# EasyEDA schematic Schematic_Ocean-240.2_v1.0.0.json

## Sheets
1 CPU: TITLE: "Океан 240.2" - CPU, ROM, Синхронизация; REV: 1.0.0; Date: 2025-08-15; Sheet: 1/7; Drawn By: Roman Boykov; Company: Romych's home
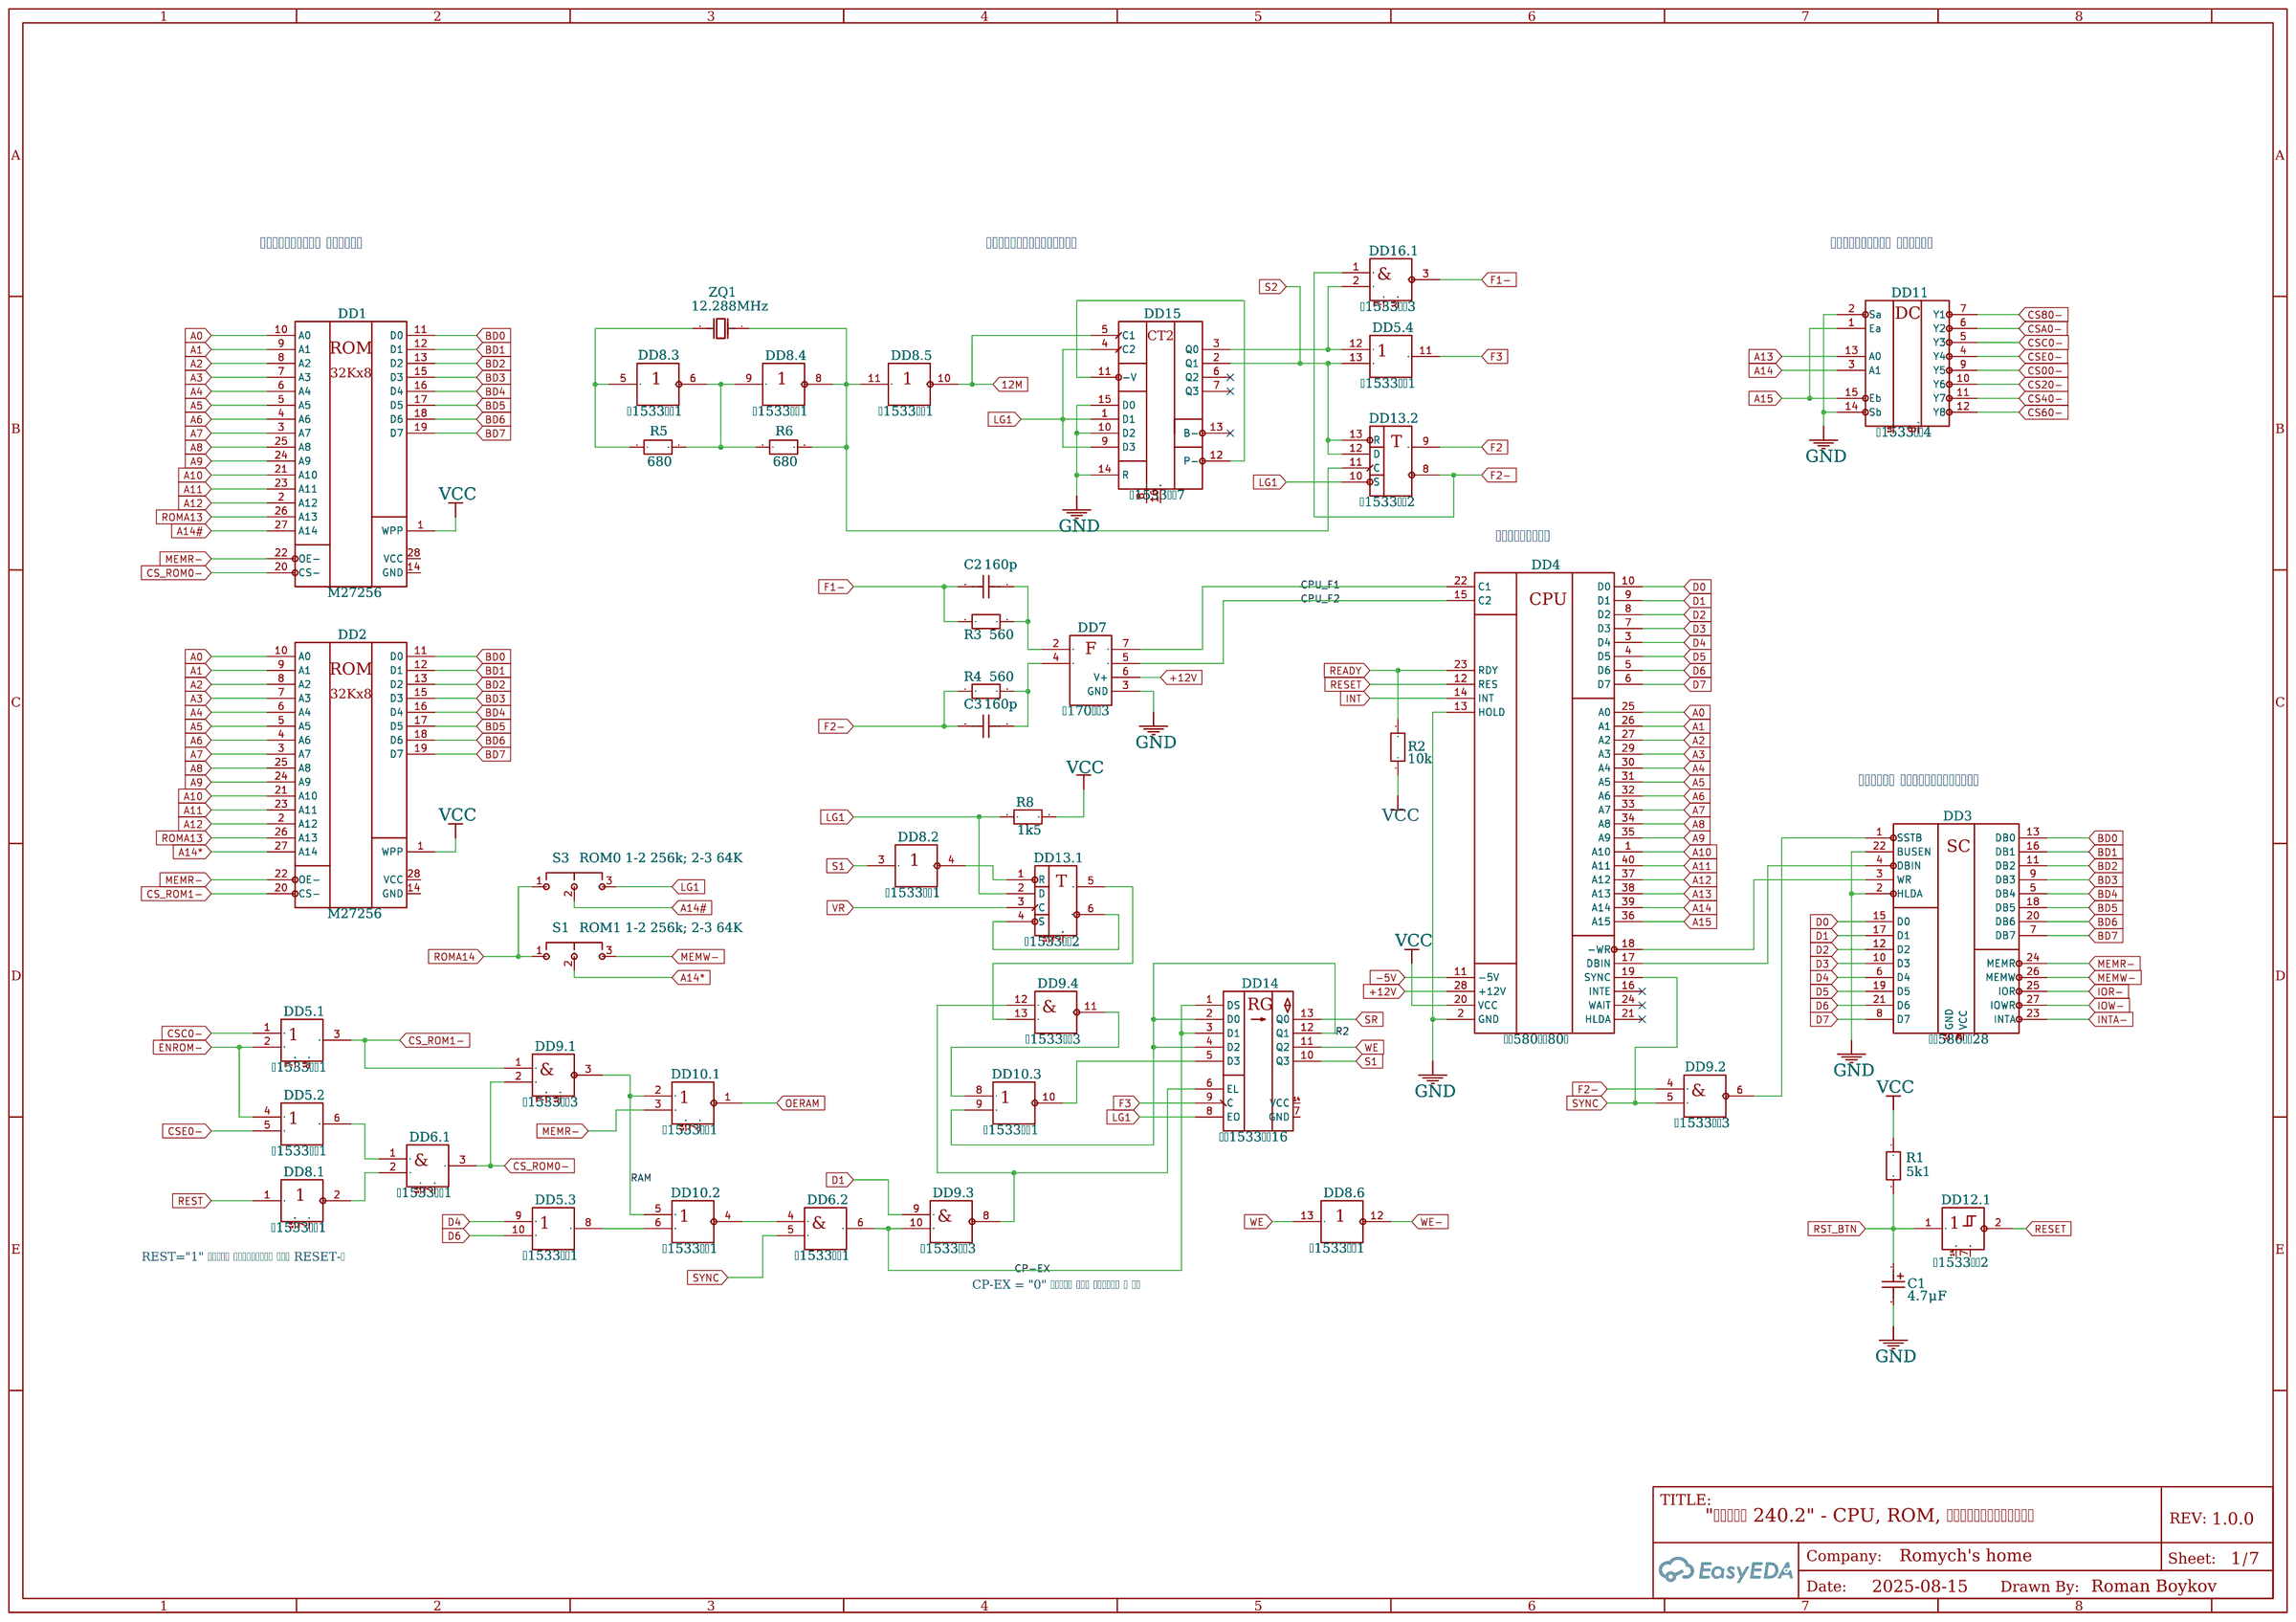
[diagram p0: CPU]
2 RAM_CTR: TITLE: "Океан 240.2" - Устройство управления ОЗУ; Sheet: 2/7
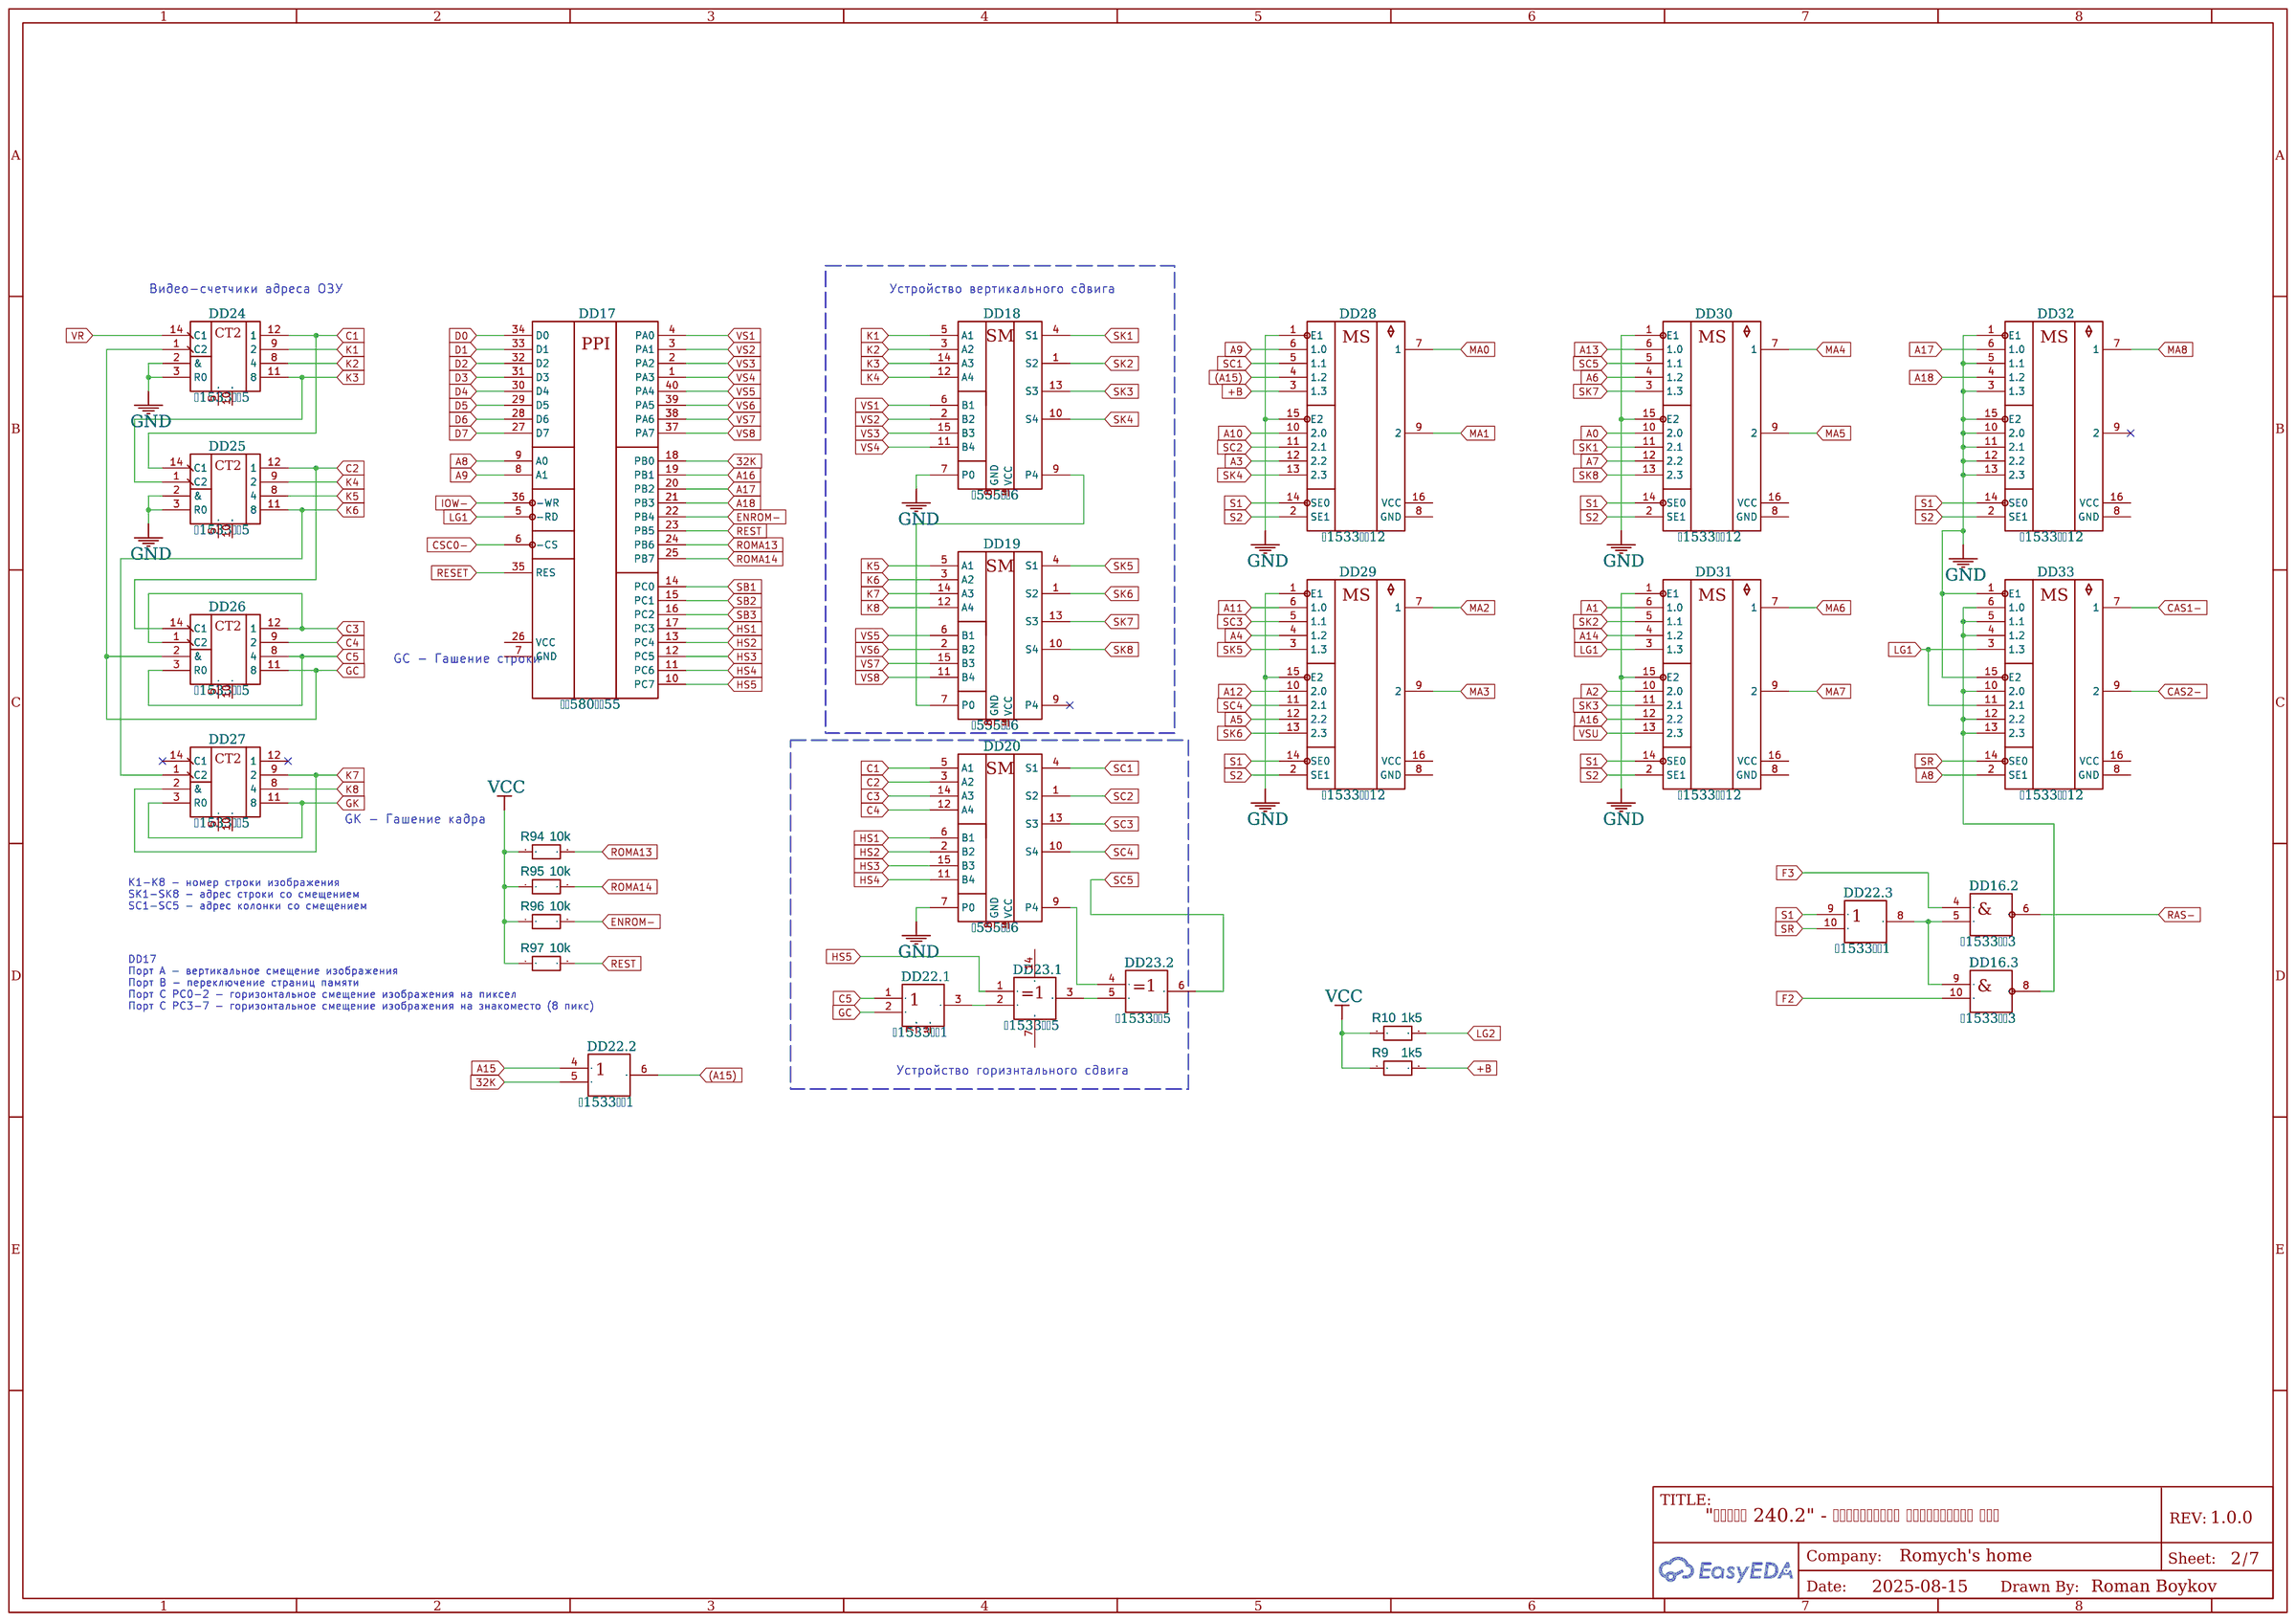
[diagram p1: RAM_CTR]
3 DRAM: TITLE: "Океан 240.2" - DRAM; Sheet: 3/7
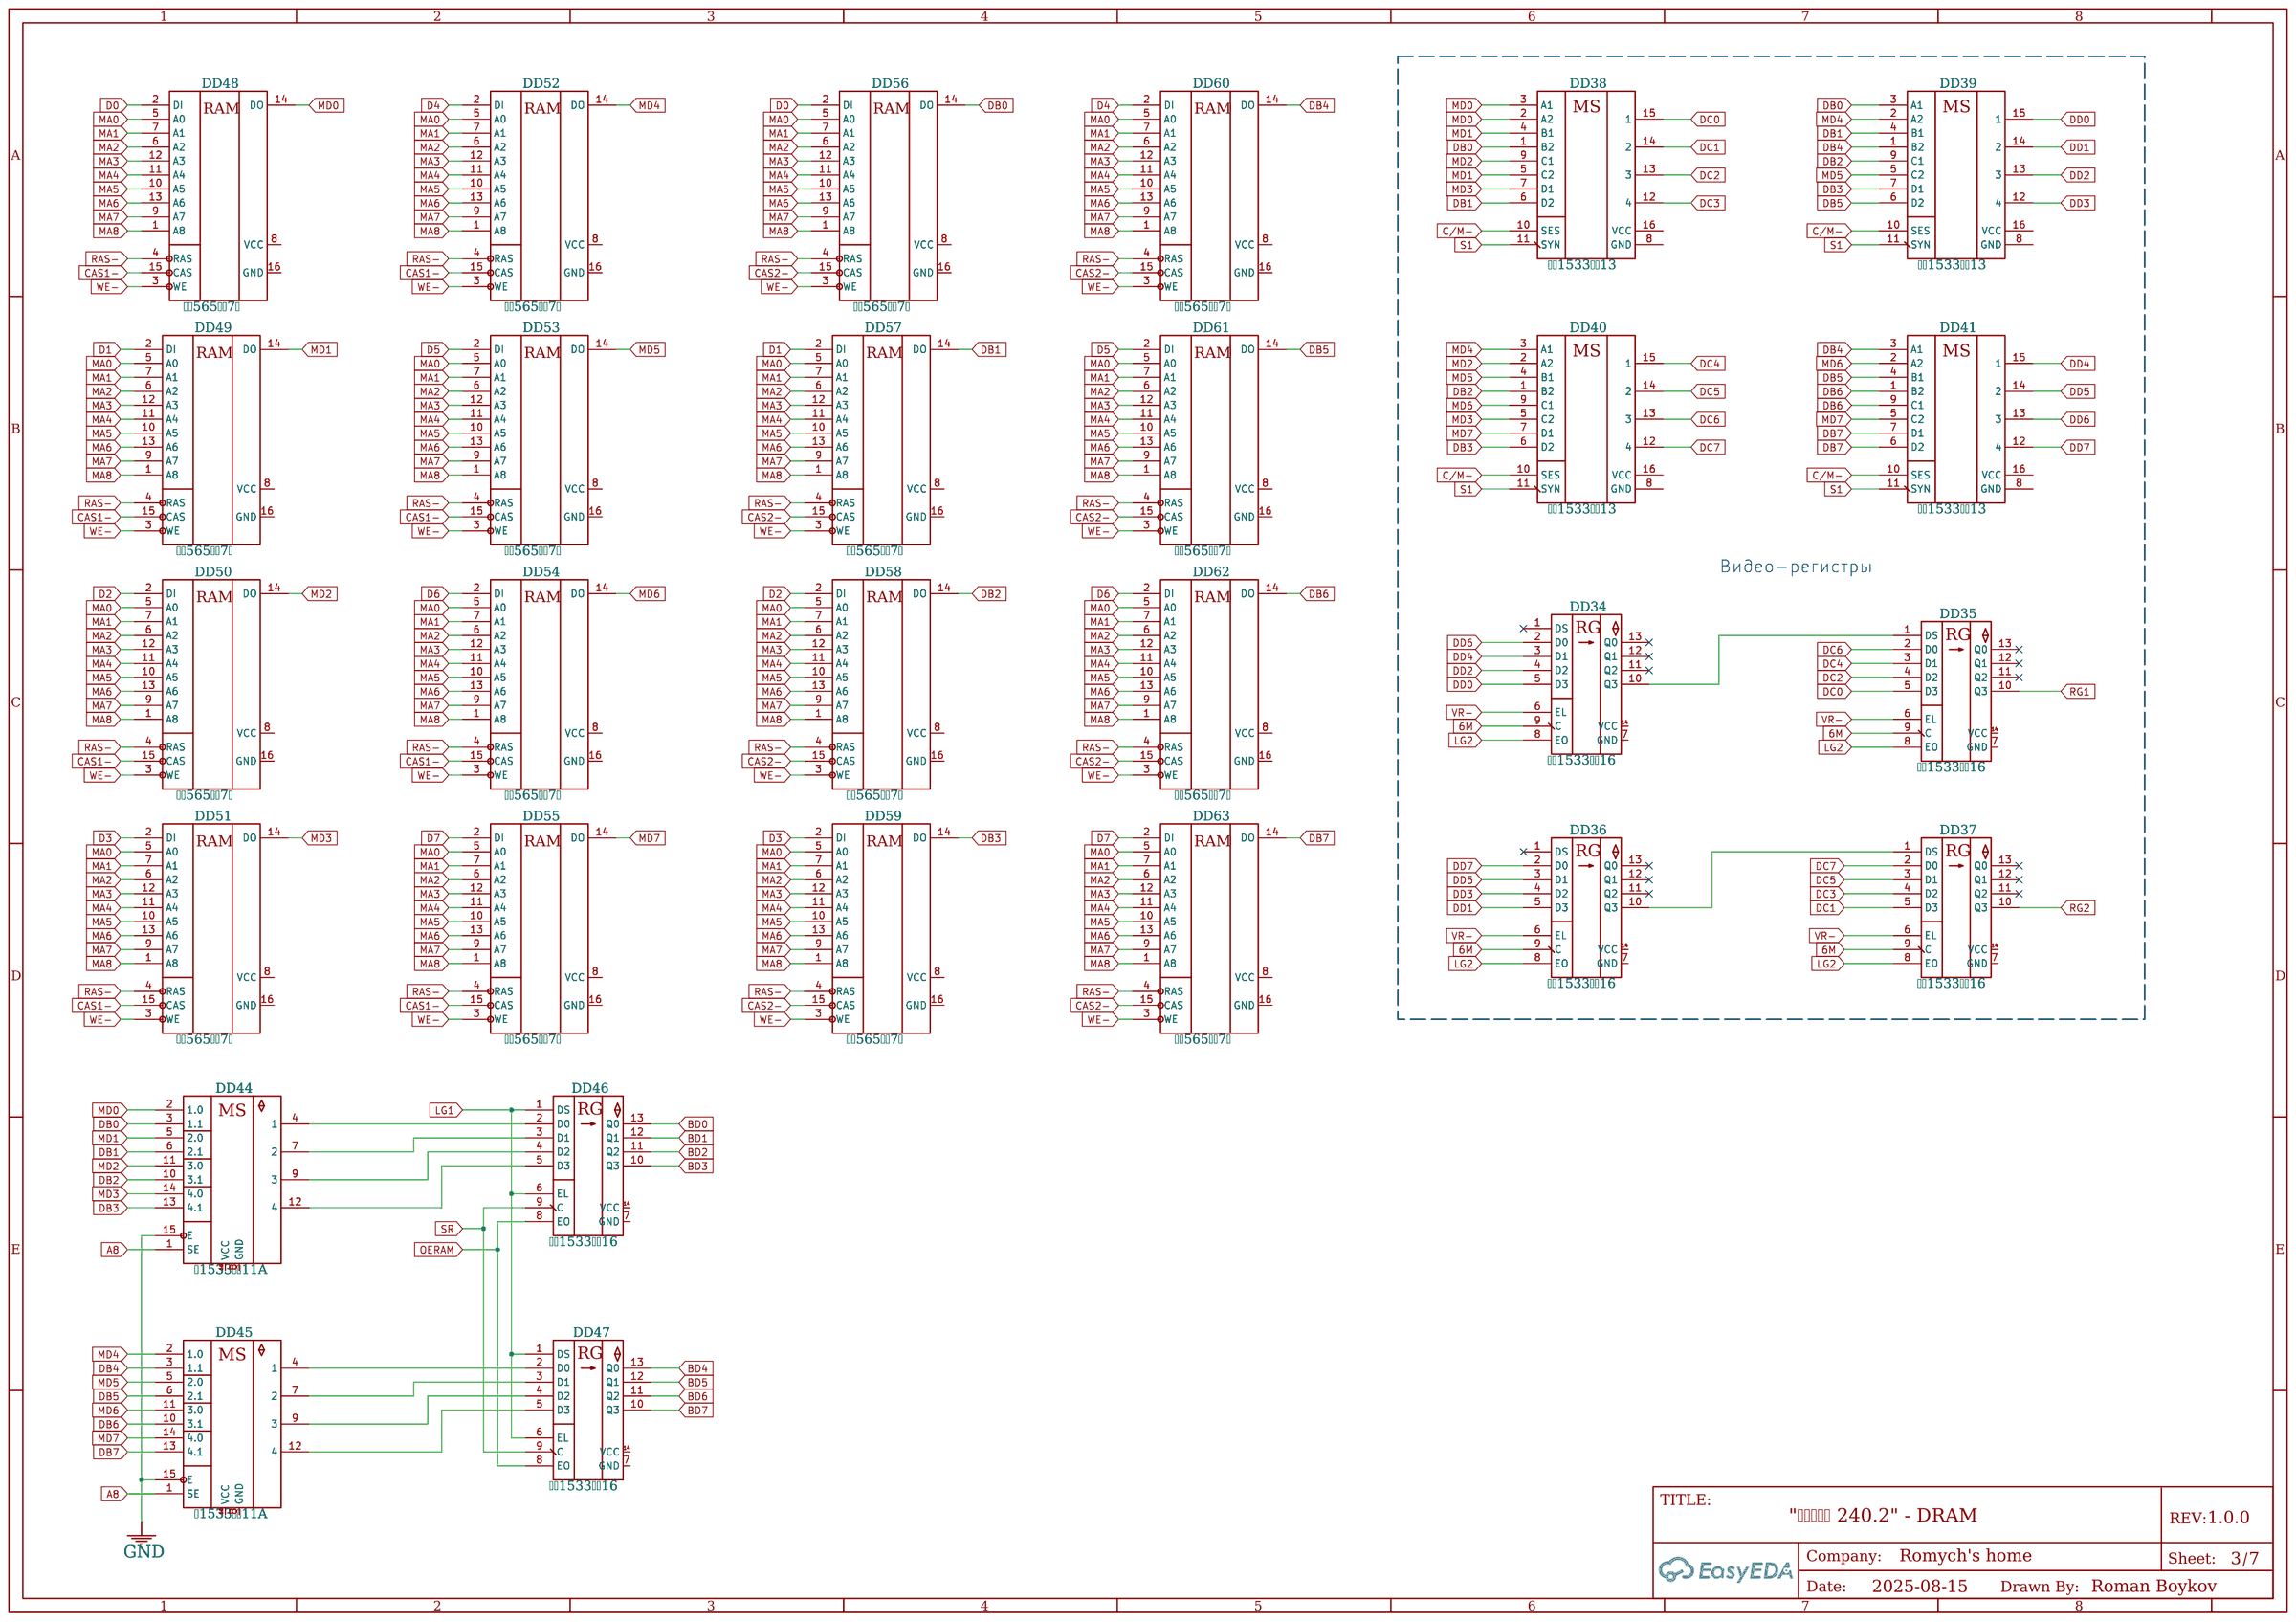
[diagram p2: DRAM]
4 Video: TITLE: "Океан 240.2" - Видео; Sheet: 4/7
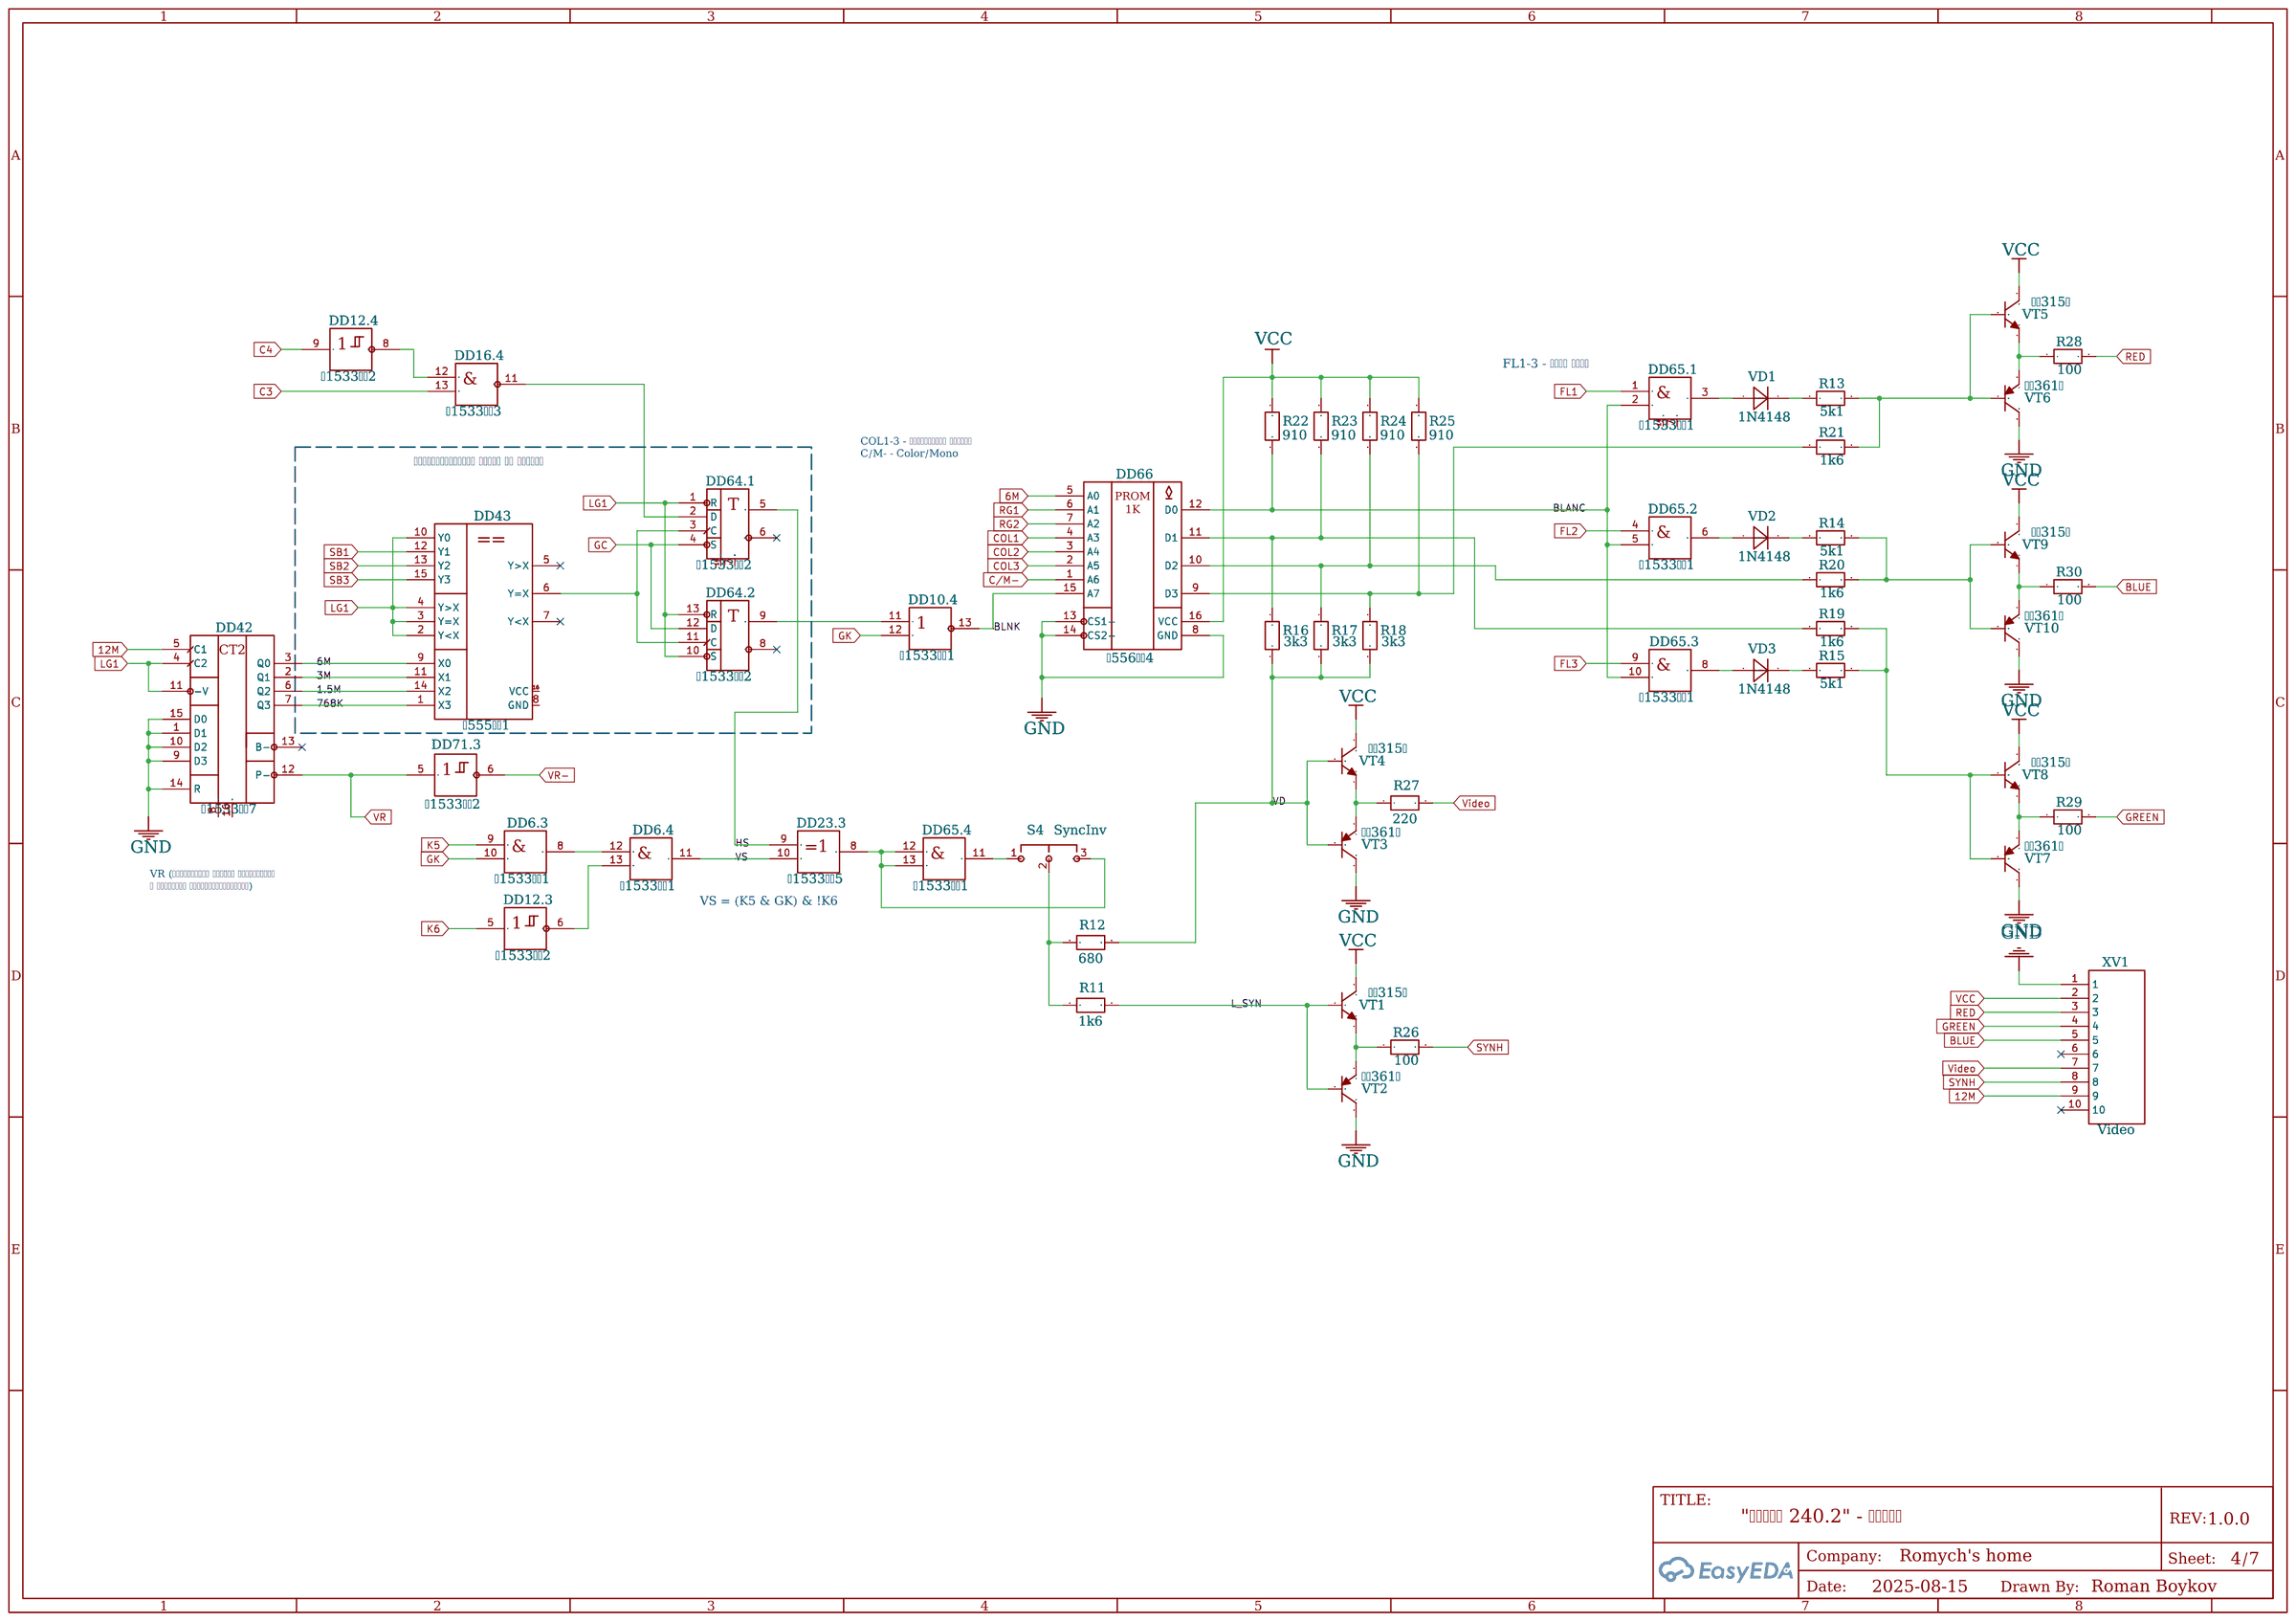
[diagram p3: Video]
5 Power: TITLE: "Океан 240.2" - Источник питания; Sheet: 5/7
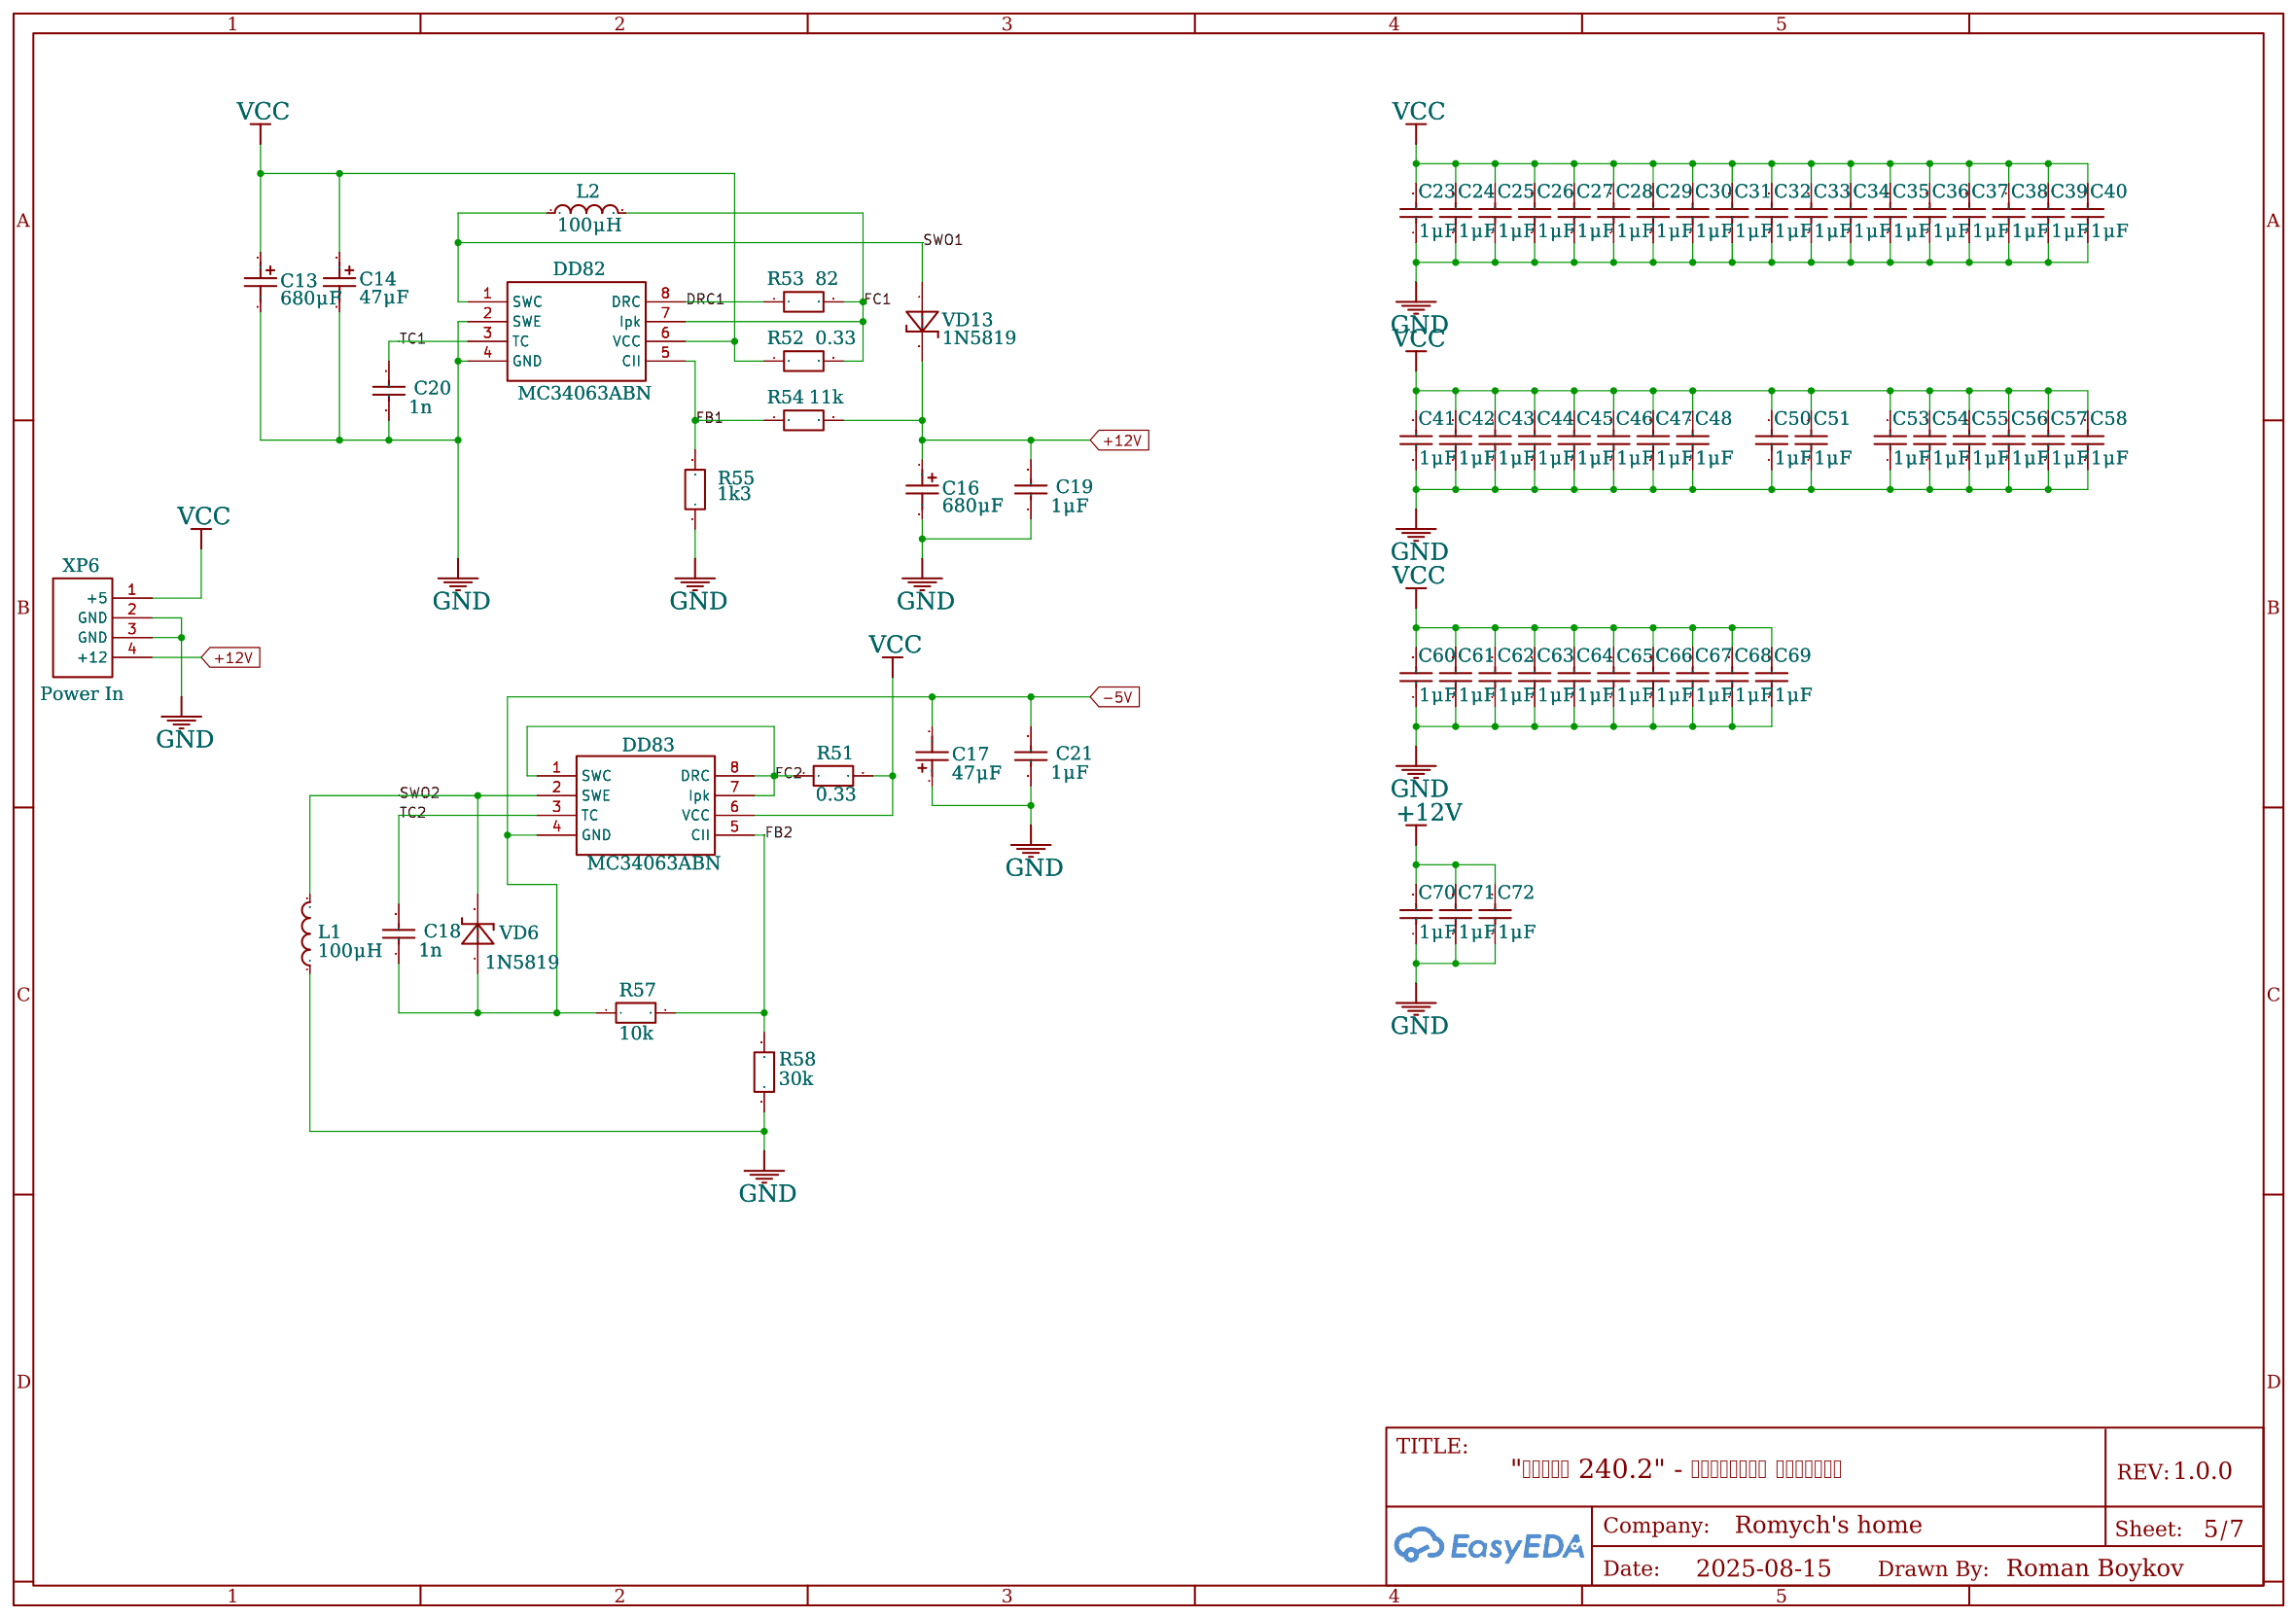
[diagram p4: Power]
6 Tape: TITLE: "Океан 240.2" - Интерфейс с магнитофоном; Date: 2025-08-08; Sheet: 6/7
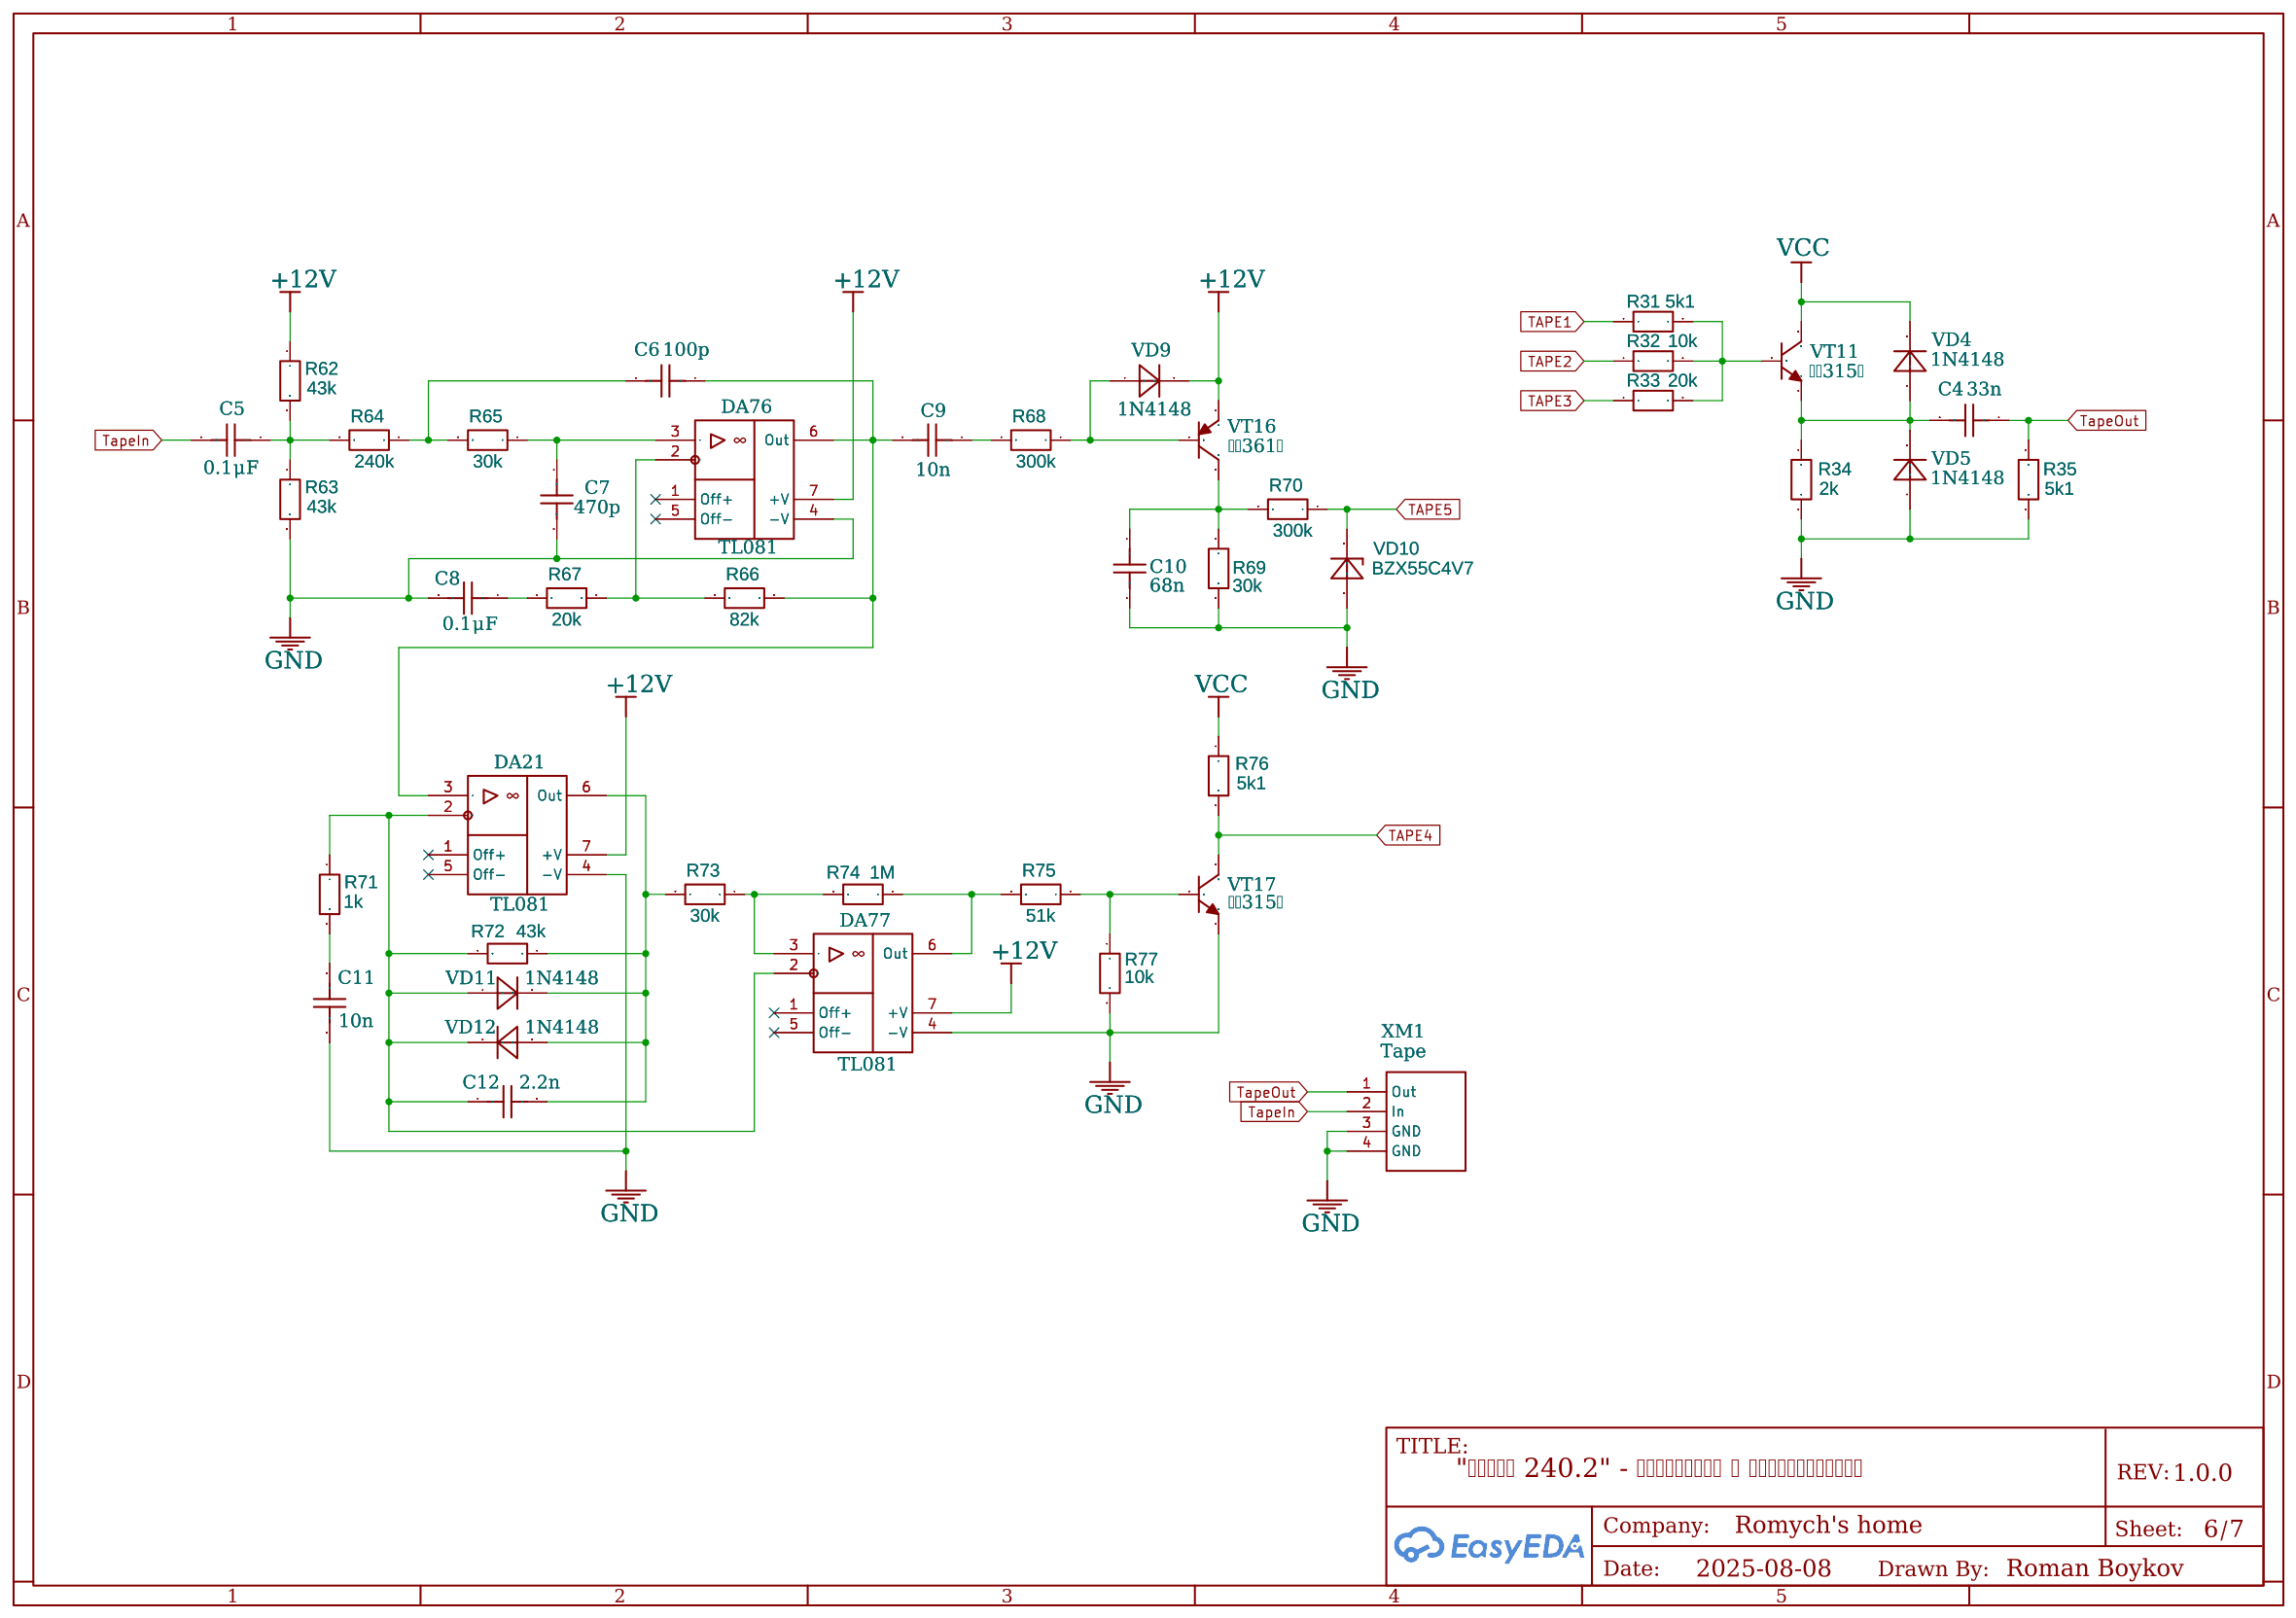
[diagram p5: Tape]
7 Interfaces: TITLE: "Океан 240.2" - Ввод/вывод; Date: 2025-08-08; Sheet: 7/7
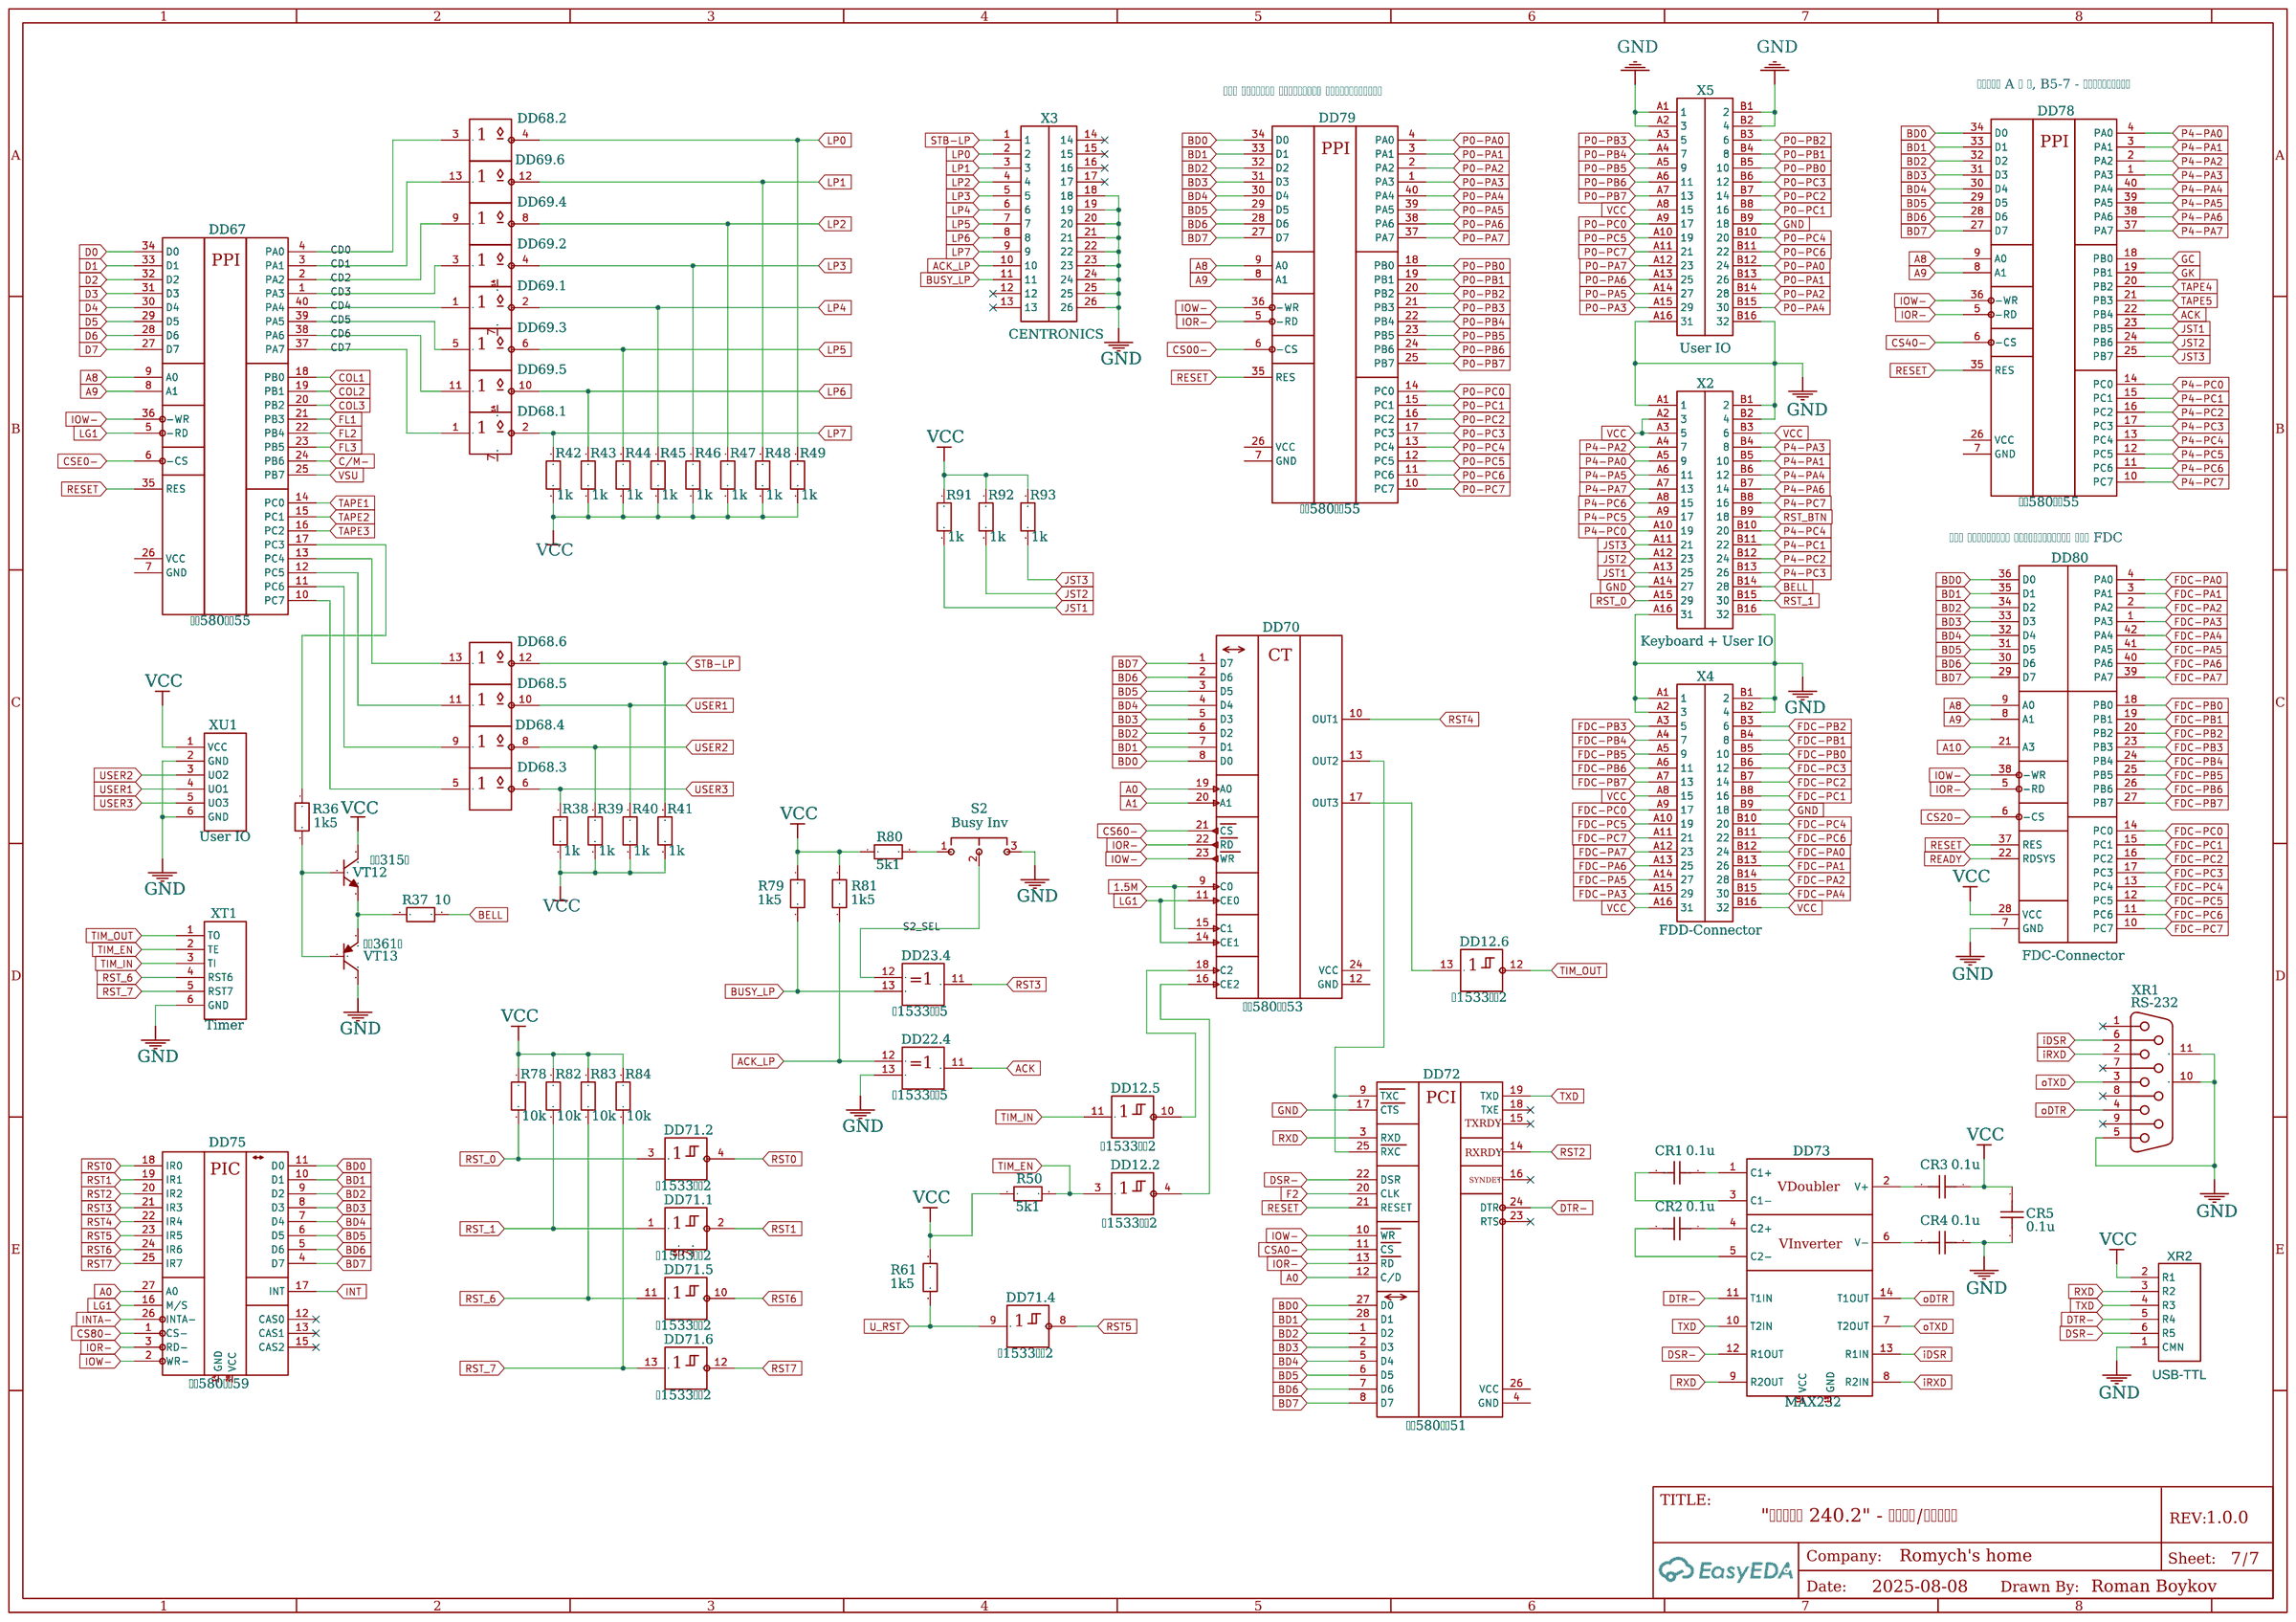
[diagram p6: Interfaces]

## Parts
sheet CPU
C1  4.7μF  [CAP_EL-TH_BD5.0_H11.0_P2.54]
C2  160p  [CAP-TH_L5.08]
C3  160p  [CAP-TH_L5.08]
DD1  M27256  [DIP-28_STD]
DD2  M27256  [DIP-28_STD]
DD3  КР580ВК28  [DIP-28_STD]
DD4  КР580ВМ80А  [DIP-40_STD]
DD5  К1533ЛЛ1  [DIP-14_STD]  (sections 1,2,3,4)
DD6  К1533ЛИ1  [DIP-14_STD]  (sections 1,2,3,4)
DD7  К170АП3  [DIP-8_STD]
DD8  К1533ЛН1  [DIP-14_STD]  (sections 1,2,3,4,5,6)
DD9  К1533ЛА3  [DIP-14_STD]  (sections 1,2,3,4)
DD10  К1533ЛЕ1  [DIP-14_STD]  (sections 1,2,3,4)
DD11  К1533ИД4  [DIP-16_STD]
DD12  К1533ТЛ2  [DIP-14_STD]  (sections 1,2,3,4,5,6)
DD13  К1533ТМ2  [DIP-14_STD]  (sections 1,2)
DD14  КР1533ИР16  [DIP-14_STD]
DD15  К1533ИЕ7  [DIP-16_STD]
DD16  К1533ЛА3  [DIP-14_STD]  (sections 1,2,3,4)
R1  5k1  [R_0.125_7.62]
R2  10k  [R_0.125_7.62]
R3  560  [R_0.125_7.62]
R4  560  [R_0.125_7.62]
R5  680  [R_0.125_7.62]
R6  680  [R_0.125_7.62]
R8  1k5  [R_0.125_7.62]
S1  ROM1 1-2 256k; 2-3 64K  [HDR-TH_3P-P2.54-V-M]
S3  ROM0 1-2 256k; 2-3 64K  [HDR-TH_3P-P2.54-V-M]
ZQ1  12.288MHz  [OSC-49U-1]
sheet DRAM
DD34  КР1533ИР16  [DIP-14_STD]
DD35  КР1533ИР16  [DIP-14_STD]
DD36  КР1533ИР16  [DIP-14_STD]
DD37  КР1533ИР16  [DIP-14_STD]
DD38  КР1533КП13  [DIP-16_STD]
DD39  КР1533КП13  [DIP-16_STD]
DD40  КР1533КП13  [DIP-16_STD]
DD41  КР1533КП13  [DIP-16_STD]
DD44  К1533КП11A  [DIP-16_STD]
DD45  К1533КП11A  [DIP-16_STD]
DD46  КР1533ИР16  [DIP-14_STD]
DD47  КР1533ИР16  [DIP-14_STD]
DD48  КР565РУ7Г  [DIP-16_STD]
DD49  КР565РУ7Г  [DIP-16_STD]
DD50  КР565РУ7Г  [DIP-16_STD]
DD51  КР565РУ7Г  [DIP-16_STD]
DD52  КР565РУ7Г  [DIP-16_STD]
DD53  КР565РУ7Г  [DIP-16_STD]
DD54  КР565РУ7Г  [DIP-16_STD]
DD55  КР565РУ7Г  [DIP-16_STD]
DD56  КР565РУ7Г  [DIP-16_STD]
DD57  КР565РУ7Г  [DIP-16_STD]
DD58  КР565РУ7Г  [DIP-16_STD]
DD59  КР565РУ7Г  [DIP-16_STD]
DD60  КР565РУ7Г  [DIP-16_STD]
DD61  КР565РУ7Г  [DIP-16_STD]
DD62  КР565РУ7Г  [DIP-16_STD]
DD63  КР565РУ7Г  [DIP-16_STD]
sheet Interfaces
CR1  0.1u  [CAP-TH_L5.08]
CR2  0.1u  [CAP-TH_L5.08]
CR3  0.1u  [CAP-TH_L5.08]
CR4  0.1u  [CAP-TH_L5.08]
CR5  0.1u  [CAP-TH_L5.08]
DD67  КР580ВВ55  [DIP-40_STD]
DD68  К1533ЛН3  [DIP-14_STD]  (sections 1,2,3,4,5,6)
DD69  К1533ЛН3  [DIP-14_STD]  (sections 1,2,3,4,5,6)
DD70  КР580ВИ53  [DIP-24_STD]
DD71  К1533ТЛ2  [DIP-14_STD]  (sections 1,2,3,4,5,6)
DD72  КР580ВВ51  [DIP-28_STD]
DD73  MAX232  [DIP-16_STD]
DD75  КР580ВН59  [DIP-28_STD]
DD78  КР580ВВ55  [DIP-40_STD]
DD79  КР580ВВ55  [DIP-40_STD]
DD80  FDC-Connector  [DIP-42_STD]
R36  1k5  [R_0.125_7.62]
R37  10  [R_0.125_7.62]
R38  1k  [R_0.125_7.62]
R39  1k  [R_0.125_7.62]
R40  1k  [R_0.125_7.62]
R41  1k  [R_0.125_7.62]
R42  1k  [R_0.125_7.62]
R43  1k  [R_0.125_7.62]
R44  1k  [R_0.125_7.62]
R45  1k  [R_0.125_7.62]
R46  1k  [R_0.125_7.62]
R47  1k  [R_0.125_7.62]
R48  1k  [R_0.125_7.62]
R49  1k  [R_0.125_7.62]
R50  5k1  [R_0.125_7.62]
R61  1k5  [R_0.125_7.62]
R78  10k  [R_0.125_7.62]
R79  1k5  [R_0.125_7.62]
R80  5k1  [R_0.125_7.62]
R81  1k5  [R_0.125_7.62]
R82  10k  [R_0.125_7.62]
R83  10k  [R_0.125_7.62]
R84  10k  [R_0.125_7.62]
R91  1k  [R_0.125_7.62]
R92  1k  [R_0.125_7.62]
R93  1k  [R_0.125_7.62]
S2  Busy Inv  [HDR-TH_3P-P2.54-V-M]
VT12  КТ315Б  [KT315_STD]
VT13  КТ361Б  [KT315_STD]
X2  Keyboard + User IO  [DIN_41612_16X2P_F]
X3  CENTRONICS  [IDC-TH_26P-P2.54M]
X4  FDD-Connector  [DIN_41612_16X2P_F]
X5  User IO  [DIN_41612_16X2P_F]
XR1  RS-232  [DB9-TH_ID09S33E4GV00LF]
XR2  USB-TTL  [HDR-TH_6P-P2.54_NR]
XT1  Timer  [HDR-TH_6P-P2.54]
XU1  User IO  [HDR-TH_6P-P2.54]
sheet Power
C13  680μF  [CAP_EL-TH_BD8.0_H15.0_P3.5]
C14  47μF  [CAP_EL-TH_BD5.0_H11.0_P2.54]
C16  680μF  [CAP_EL-TH_BD8.0_H15.0_P3.5]
C17  47μF  [CAP_EL-TH_BD5.0_H11.0_P2.54]
C18  1n  [CAP-TH_L5.08]
C19  1μF  [CAP-TH_L5.08]
C20  1n  [CAP-TH_L5.08]
C21  1μF  [CAP-TH_L5.08]
C23  1μF  [CAP-TH_L7.62]
C24  1μF  [CAP-TH_L7.62]
C25  1μF  [CAP-TH_L7.62]
C26  1μF  [CAP-TH_L7.62]
C27  1μF  [CAP-TH_L7.62]
C28  1μF  [CAP-TH_L7.62]
C29  1μF  [CAP-TH_L7.62]
C30  1μF  [CAP-TH_L7.62]
C31  1μF  [CAP-TH_L7.62]
C32  1μF  [CAP-TH_L7.62]
C33  1μF  [CAP-TH_L7.62]
C34  1μF  [CAP-TH_L7.62]
C35  1μF  [CAP-TH_L7.62]
C36  1μF  [CAP-TH_L7.62]
C37  1μF  [CAP-TH_L7.62]
C38  1μF  [CAP-TH_L7.62]
C39  1μF  [CAP-TH_L7.62]
C40  1μF  [CAP-TH_L7.62]
C41  1μF  [CAP-TH_L7.62]
C42  1μF  [CAP-TH_L7.62]
C43  1μF  [CAP-TH_L7.62]
C44  1μF  [CAP-TH_L7.62]
C45  1μF  [CAP-TH_L7.62]
C46  1μF  [CAP-TH_L7.62]
C47  1μF  [CAP-TH_L7.62]
C48  1μF  [CAP-TH_L7.62]
C50  1μF  [CAP-TH_L7.62]
C51  1μF  [CAP-TH_L7.62]
C53  1μF  [CAP-TH_L7.62]
C54  1μF  [CAP-TH_L7.62]
C55  1μF  [CAP-TH_L7.62]
C56  1μF  [CAP-TH_L7.62]
C57  1μF  [CAP-TH_L7.62]
C58  1μF  [CAP-TH_L7.62]
C60  1μF  [CAP-TH_L7.62]
C61  1μF  [CAP-TH_L7.62]
C62  1μF  [CAP-TH_L7.62]
C63  1μF  [CAP-TH_L7.62]
C64  1μF  [CAP-TH_L7.62]
C65  1μF  [CAP-TH_L7.62]
C66  1μF  [CAP-TH_L7.62]
C67  1μF  [CAP-TH_L7.62]
C68  1μF  [CAP-TH_L7.62]
C69  1μF  [CAP-TH_L7.62]
C70  1μF  [CAP-TH_L7.62]
C71  1μF  [CAP-TH_L7.62]
C72  1μF  [CAP-TH_L7.62]
DD82  MC34063ABN  [DIP-8_STD]
DD83  MC34063ABN  [DIP-8_STD]
L1  100μH  [RES-TH_0.5W_12.7]
L2  100μH  [RES-TH_0.5W_12.7]
R51  0.33  [R_0.125_7.62]
R52  0.33  [R_0.125_7.62]
R53  82  [R_0.125_7.62]
R54  11k  [R_0.125_7.62]
R55  1k3  [R_0.125_7.62]
R57  10k  [R_0.125_7.62]
R58  30k  [R_0.125_7.62]
VD6  1N5819  [DO-41_STD_P10.16]
VD13  1N5819  [DO-41_STD_P10.16]
XP6  Power In  [CONN-TH-4P-JVC_MINI]
sheet RAM_CTR
DD17  КР580ВВ55  [DIP-40_STD]
DD18  К555ИМ6  [DIP-16_STD]
DD19  К555ИМ6  [DIP-16_STD]
DD20  К555ИМ6  [DIP-16_STD]
DD22  К1533ЛЛ1  [DIP-14_STD]  (sections 1,2,3,4)
DD23  К1533ЛП5  [DIP-14_STD]  (sections 1,2,3,4)
DD24  К1533ИЕ5  [DIP-14_STD]
DD25  К1533ИЕ5  [DIP-14_STD]
DD26  К1533ИЕ5  [DIP-14_STD]
DD27  К1533ИЕ5  [DIP-14_STD]
DD28  К1533КП12  [DIP-16_STD]
DD29  К1533КП12  [DIP-16_STD]
DD30  К1533КП12  [DIP-16_STD]
DD31  К1533КП12  [DIP-16_STD]
DD32  К1533КП12  [DIP-16_STD]
DD33  К1533КП12  [DIP-16_STD]
R9  1k5  [R_0.125_7.62]
R10  1k5  [R_0.125_7.62]
R94  10k  [R_0.125_7.62]
R95  10k  [R_0.125_7.62]
R96  10k  [R_0.125_7.62]
R97  10k  [R_0.125_7.62]
sheet Tape
C4  33n  [CAP-TH_L5.08]
C5  0.1μF  [CAP-TH_L7.62]
C6  100p  [CAP-TH_L7.62]
C7  470p  [CAP-TH_L5.08]
C8  0.1μF  [CAP-TH_L7.62]
C9  10n  [CAP-TH_L7.62]
C10  68n  [CAP-TH_L7.62]
C11  10n  [CAP-TH_L7.62]
C12  2.2n  [CAP-TH_L7.62]
DA21  TL081  [DIP-8_STD]
DA76  TL081  [DIP-8_STD]
DA77  TL081  [DIP-8_STD]
R31  5k1  [R_0.125_7.62]
R32  10k  [R_0.125_7.62]
R33  20k  [R_0.125_7.62]
R34  2k  [R_0.125_7.62]
R35  5k1  [R_0.125_7.62]
R62  43k  [R_0.125_7.62]
R63  43k  [R_0.125_7.62]
R64  240k  [R_0.125_7.62]
R65  30k  [R_0.125_7.62]
R66  82k  [R_0.125_7.62]
R67  20k  [R_0.125_7.62]
R68  300k  [R_0.125_7.62]
R69  30k  [R_0.125_7.62]
R70  300k  [R_0.125_7.62]
R71  1k  [R_0.125_7.62]
R72  43k  [R_0.125_7.62]
R73  30k  [R_0.125_7.62]
R74  1M  [R_0.125_7.62]
R75  51k  [R_0.125_7.62]
R76  5k1  [R_0.125_7.62]
R77  10k  [R_0.125_7.62]
VD4  1N4148  [DIODE_TH_7.62]
VD5  1N4148  [DIODE_TH_7.62]
VD9  1N4148  [DIODE_TH_7.62]
VD10  BZX55C4V7  [DO-35_TH_7.62H]
VD11  1N4148  [DIODE_TH_7.62]
VD12  1N4148  [DIODE_TH_7.62]
VT11  КТ315Б  [KT315_STD]
VT16  КТ361Б  [KT315_STD]
VT17  КТ315Б  [KT315_STD]
XM1  Tape  [HDR-TH_4P-P2.54]
sheet Video
DD42  К1533ИЕ7  [DIP-16_STD]
DD43  К555СП1  [DIP-16_STD]
DD64  К1533ТМ2  [DIP-14_STD]  (sections 1,2)
DD65  К1533ЛИ1  [DIP-14_STD]  (sections 1,2,3,4)
DD66  К556РТ4  [DIP-16_STD]
R11  1k6  [R_0.125_7.62]
R12  680  [R_0.125_7.62]
R13  5k1  [R_0.125_7.62]
R14  5k1  [R_0.125_7.62]
R15  5k1  [R_0.125_7.62]
R16  3k3  [R_0.125_7.62]
R17  3k3  [R_0.125_7.62]
R18  3k3  [R_0.125_7.62]
R19  1k6  [R_0.125_7.62]
R20  1k6  [R_0.125_7.62]
R21  1k6  [R_0.125_7.62]
R22  910  [R_0.125_7.62]
R23  910  [R_0.125_7.62]
R24  910  [R_0.125_7.62]
R25  910  [R_0.125_7.62]
R26  100  [R_0.125_7.62]
R27  220  [R_0.125_7.62]
R28  100  [R_0.125_7.62]
R29  100  [R_0.125_7.62]
R30  100  [R_0.125_7.62]
S4  SyncInv  [HDR-TH_3P-P2.54-V-M]
VD1  1N4148  [DIODE_TH_7.62]
VD2  1N4148  [DIODE_TH_7.62]
VD3  1N4148  [DIODE_TH_7.62]
VT1  КТ315Б  [KT315_STD]
VT2  КТ361Б  [KT315_STD]
VT3  КТ361Б  [KT315_STD]
VT4  КТ315Б  [KT315_STD]
VT5  КТ315Б  [KT315_STD]
VT6  КТ361Б  [KT315_STD]
VT7  КТ361Б  [KT315_STD]
VT8  КТ315Б  [KT315_STD]
VT9  КТ315Б  [KT315_STD]
VT10  КТ361Б  [KT315_STD]
XV1  Video  [HDR-TH_10P-P2.54-V-F]

## Library data of the parts
C1 C13 C14 C16 C17 = CAP_EL-TH_5x11: Contributor: Roman Boykov
C2-C12 CR1-CR5 = CK45-R3AD152K-VRY: Supplier: LCSC; Supplier Part: C340608; Manufacturer: TDK; Contributor: LCSC
DD1 DD2 = M27256: Supplier: chipdip; Contributor: romychs_4693
DD3 = КР580ВК28: Contributor: romychs_4693
DD4 = КР580ВМ80А: Contributor: romychs_4693
DD5 DD22 = К1533ЛЛ1: Supplier: chipdip; Contributor: Roman Boykov; subpart_no: 1
DD6 DD65 = К1533ЛИ1: Supplier: chipdip; Contributor: Roman Boykov; subpart_no: 1
DD7 = К170АП3: Contributor: romychs_4693
DD8 = К1533ЛН1: Supplier: chipdip; Contributor: Roman Boykov; subpart_no: 7
DD9 DD16 = К1533ЛА3: Supplier: chipdip; Contributor: Roman Boykov; subpart_no: 1
DD10 = К1533ЛЕ1: Supplier: chipdip; Contributor: Roman Boykov; subpart_no: 1
DD11 = К1533ИД4: Supplier: chipdip; Contributor: romychs_4693
DD12 = К1533ТЛ2: Supplier: chipdip; Contributor: Roman Boykov; subpart_no: 7
DD13 DD64 = К1533ТМ2: Supplier: chipdip; Contributor: romychs_4693; subpart_no: 3
DD14 DD34-DD37 DD46 DD47 = КР1533ИР16: Supplier: chipdip; Contributor: romychs_4693
DD15 DD42 = К1533ИЕ7: Contributor: romychs_4693
R1-R6 R8-R55 R57 R58 R61-R84 R91-R97 = RES_TH_W0.125_P7.62: Contributor: romychs_4693
S1-S4 = Jumper-3PM: Contributor: romychs_4693
ZQ1 = X49UD12MSD2SC: Supplier: LCSC; Manufacturer: YXC; Supplier Part: C2188
DD38-DD41 = КР1533КП13: Supplier: chipdip; Contributor: romychs_4693
DD44 DD45 = К1533КП11A: Supplier: chipdip; Contributor: Roman Boykov
DD48-DD63 = КР565РУ7Г: Supplier: chipdip; Contributor: Roman Boykov
DD17 DD67 DD78 DD79 = КР580ВВ55: Supplier: chipdip; Contributor: romychs_4693
DD68 DD69 = К1533ЛН3: Supplier Part: SN7406; Supplier: chipdip; Contributor: Roman Boykov; subpart_no: 7
DD70 = КР580ВИ53: Supplier: chip-dip; Contributor: romychs_4693
DD71 = К1533ТЛ2: Supplier: chipdip; Contributor: Roman Boykov; subpart_no: 8
DD72 = КР580ВВ51: Supplier: chip-dip; Contributor: romychs_4693
DD73 = MAX232: Manufacturer: Maxim-IC; Contributor: romychs_4693
DD75 = КР580ВН59: Contributor: romychs_4693
DD80 = O280-FDC-CONN: Contributor: romychs_4693
VT1 VT4 VT5 VT8 VT9 VT11 VT12 VT17 = КТ315Б: Supplier: LCSC; Manufacturer: Russia; Manufacturer Part: КТ315; Supplier Part: КТ315; JLCPCB Part Class: Extended Part
VT2 VT3 VT6 VT7 VT10 VT13 VT16 = КТ361Б: Supplier Part: КТ361; Manufacturer: Changjiang Electronics Tech (CJ); Manufacturer Part: Russia; Contributor: LCSC; JLCPCB Part Class: Extended Part
X2 X4 X5 = DIN41612 16x2: Contributor: Roman Boykov; Convert to PCB: Yes; Add into BOM: Yes
X3 = IDC-TH-26P: Contributor: Roman Boykov
XR1 = ID09S33E4GV00LF: Supplier: LCSC; Supplier Part: C185657; Manufacturer: Amphenol ICC; Contributor: LCSC
XR2 = НР-5: Supplier: chipdip; Contributor: Roman Boykov
XT1 XU1 = Atmega-ISP-6P: Contributor: romychs_4693
C18-C21 C23-C48 C50 C51 C53-C58 C60-C72 = 0805CG0R5C500NT: Supplier: LCSC; Manufacturer: FH; Supplier Part: C1784
DD82 DD83 = MC34063ABN: Manufacturer: ST; link: http://www.st.com; Contributor: Roman Boykov
L1 L2 = CD105NP-101KC: Supplier: LCSC; Supplier Part: C540967; Manufacturer: Vishay Intertech; Manufacturer Part: IHLP2525CZER2R2M01; Contributor: LCSC; JLCPCB Part Class: Extended Part
VD6 VD13 = 1N5819: Manufacturer: ST; Contributor: romychs_4693
XP6 = JVC Mini-4P: Contributor: romychs_4693
DD18-DD20 = К555ИМ6: Contributor: Roman Boykov
DD23 = К1533ЛП5: Supplier: chipdip; Contributor: Roman Boykov; subpart_no: 1
DD24-DD27 = К1533ИЕ5: Supplier: chipdip; Contributor: romychs_4693; subpart_no: 4
DD28-DD33 = К1533КП12: Supplier: chipdip; Contributor: romychs_4693
DA21 DA76 DA77 = TL081: Manufacturer: Texas Instruments; Manufacturer Part: TL081ACP; Contributor: Roman Boykov
VD1-VD5 VD9 VD11 VD12 = 1N4148: Manufacturer: DIODES; Contributor: romychs_4693
VD10 = BZX55-C4V7: Manufacturer: DIODES; Contributor: romychs_4693
XM1 = PinHeader_1x4: Contributor: Roman Boykov
DD43 = К555СП1: Contributor: romychs_4693
DD66 = К556РТ4: Contributor: romychs_4693
XV1 = PinHeader_10X1: Supplier: chipdip; Contributor: Roman Boykov

## Nets
+12V: C16.1(P) C19.2 C70.2 C71.2 C72.2 DA21.7(+V) DA76.7(+V) DA77.7(+V) DD4.28(+12V) DD7.6(V+) R54.2 R62.1 VD9.2 VD13.2 VT16.1(E) XP6.4(+12)
-5V: C17.2(N) C18.1 C21.2 DD4.11(-5V) DD83.4(GND) R57.1 VD6.1
GND: C1.2(N) C7.2 C8.2 C10.2 C11.2 C13.2(N) C14.2(N) C16.2(N) C17.1(P) C19.1 C20.1 C21.1 C23.1 C24.1 C25.1 C26.1 C27.1 C28.1 C29.1 C30.1 C31.1 C32.1 C33.1 C34.1 C35.1 C36.1 C37.1 C38.1 C39.1 C40.1 C41.1 C42.1 C43.1 C44.1 C45.1 C46.1 C47.1 C48.1 C50.1 C51.1 C53.1 C54.1 C55.1 C56.1 C57.1 C58.1 C60.1 C61.1 C62.1 C63.1 C64.1 C65.1 C66.1 C67.1 C68.1 C69.1 C70.1 C71.1 C72.1 CR4.1 CR5.2 DA21.4(-V) DA76.4(-V) DA77.4(-V) DD3.2(HLDA) DD3.22(BUSEN) DD4.2(GND) DD4.13(HOLD) DD7.3(GND) DD11.2(Sa) DD11.14(Sb) DD15.10(D2) DD15.14(R) DD15.15(D0) DD18.7(P0) DD20.7(P0) DD22.13(2) DD24.2(&) DD24.3(R0) DD25.2(&) DD25.3(R0) DD28.1(E1) DD28.15(E2) DD29.1(E1) DD29.15(E2) DD30.1(E1) DD30.15(E2) DD31.1(E1) DD31.15(E2) DD32.1(E1) DD32.3(1.3) DD32.5(1.1) DD32.10(2.0) DD32.11(2.1) DD32.12(2.2) DD32.13(2.3) DD32.15(E2) DD33.1(E1) DD33.15(E2) DD42.1(D1) DD42.9(D3) DD42.10(D2) DD42.14(R) DD42.15(D0) DD44.15(E) DD45.15(E) DD66.8(GND) DD66.13(CS1-) DD66.14(CS2-) DD72.17(CTS) DD80.7(GND) DD82.2(SWE) DD82.4(GND) L1.1 R34.2 R35.2 R55.1 R58.1 R63.2 R69.2 R77.2 S2.3 VD5.1 VD10.1 VT2.2(C) VT3.2(C) VT6.2(C) VT7.2(C) VT10.2(C) VT13.2(C) VT17.1(E) X2.A1(1) X2.A14(27) X2.A16(31) X2.B1(2) X2.B2(4) X2.B16(32) X3.18 X3.19 X3.20 X3.21 X3.22 X3.23 X3.24 X3.25 X3.26 X4.A1(1) X4.A2(3) X4.B1(2) X4.B2(4) X4.B9(18) X5.A1(1) X5.A2(3) X5.A16(31) X5.B1(2) X5.B2(4) X5.B9(18) X5.B16(32) XM1.3(GND) XM1.4(GND) XP6.2(GND) XP6.3(GND) XR1.5 XR1.10(MH1) XR1.11(MH2) XR2.1(CMN) XT1.6(GND) XU1.2(GND) XU1.6(GND) XV1.1
VCC: C13.1(P) C14.1(P) C23.2 C24.2 C25.2 C26.2 C27.2 C28.2 C29.2 C30.2 C31.2 C32.2 C33.2 C34.2 C35.2 C36.2 C37.2 C38.2 C39.2 C40.2 C41.2 C42.2 C43.2 C44.2 C45.2 C46.2 C47.2 C48.2 C50.2 C51.2 C53.2 C54.2 C55.2 C56.2 C57.2 C58.2 C60.2 C61.2 C62.2 C63.2 C64.2 C65.2 C66.2 C67.2 C68.2 C69.2 CR3.1 CR5.1 DD1.1(WPP) DD2.1(WPP) DD4.20(VCC) DD66.16(VCC) DD80.28(VCC) DD82.6(VCC) DD83.6(VCC) R1.1 R2.1 R8.2 R9.1 R10.1 R22.1 R23.1 R24.1 R25.1 R38.2 R39.2 R40.2 R41.2 R42.2 R43.2 R44.2 R45.2 R46.2 R47.2 R48.2 R49.2 R50.1 R51.2 R52.1 R61.1 R76.1 R78.1 R79.1 R80.1 R81.1 R82.1 R83.1 R84.1 R91.1 R92.1 R93.1 R94.1 R95.1 R96.1 R97.1 VD4.2 VT1.2(C) VT4.2(C) VT5.2(C) VT8.2(C) VT9.2(C) VT11.2(C) VT12.2(C) X2.A2(3) X2.A3(5) X2.B3(6) X4.A8(15) X4.A16(31) X4.B16(32) X5.A8(15) XP6.1(+5) XR2.2(R1) XU1.1(VCC) XV1.2
1.5M: DD42.6(Q2) DD43.14(X2) DD70.9(C0) DD70.15(C1)
3M: DD42.2(Q1) DD43.11(X1)
6M: DD34.9(C) DD35.9(C) DD36.9(C) DD37.9(C) DD42.3(Q0) DD43.9(X0) DD66.5(A0)
12M: DD8.10(2) DD15.5(C1) DD42.5(C1) XV1.9
32K: DD17.18(PB0) DD22.5(2)
768K: DD42.7(Q3) DD43.1(X3)
(A15): DD22.6(3) DD28.4(1.2)
+B: DD28.3(1.3) R9.2
A0: DD1.10(A0) DD2.10(A0) DD4.25(A0) DD30.10(2.0) DD70.19(A0) DD72.12(C/D) DD75.27(A0)
A1: DD1.9(A1) DD2.9(A1) DD4.26(A1) DD31.6(1.0) DD70.20(A1)
A2: DD1.8(A2) DD2.8(A2) DD4.27(A2) DD31.10(2.0)
A3: DD1.7(A3) DD2.7(A3) DD4.29(A3) DD28.12(2.2)
A4: DD1.6(A4) DD2.6(A4) DD4.30(A4) DD29.4(1.2)
A5: DD1.5(A5) DD2.5(A5) DD4.31(A5) DD29.12(2.2)
A6: DD1.4(A6) DD2.4(A6) DD4.32(A6) DD30.4(1.2)
A7: DD1.3(A7) DD2.3(A7) DD4.33(A7) DD30.12(2.2)
A8: DD1.25(A8) DD2.25(A8) DD4.34(A8) DD17.9(A0) DD33.2(SE1) DD44.1(SE) DD45.1(SE) DD67.9(A0) DD78.9(A0) DD79.9(A0) DD80.9(A0)
A9: DD1.24(A9) DD2.24(A9) DD4.35(A9) DD17.8(A1) DD28.6(1.0) DD67.8(A1) DD78.8(A1) DD79.8(A1) DD80.8(A1)
A10: DD1.21(A10) DD2.21(A10) DD4.1(A10) DD28.10(2.0) DD80.21(A3)
A11: DD1.23(A11) DD2.23(A11) DD4.40(A11) DD29.6(1.0)
A12: DD1.2(A12) DD2.2(A12) DD4.37(A12) DD29.10(2.0)
A13: DD4.38(A13) DD11.13(A0) DD30.6(1.0)
A14: DD4.39(A14) DD11.3(A1) DD31.4(1.2)
A14#: DD1.27(A14) S3.2
A14*: DD2.27(A14) S1.2
A15: DD4.36(A15) DD11.1(Ea) DD11.15(Eb) DD22.4(1)
A16: DD17.19(PB1) DD31.12(2.2)
A17: DD17.20(PB2) DD32.6(1.0)
A18: DD17.21(PB3) DD32.4(1.2)
ACK: DD22.11(3) DD78.22(PB4)
ACK_LP: DD22.12(1) R81.2 X3.10
BD0: DD1.11(D0) DD2.11(D0) DD3.13(DB0) DD46.13(Q0) DD70.8(D0) DD72.27(D0) DD75.11(D0) DD78.34(D0) DD79.34(D0) DD80.36(D0)
BD1: DD1.12(D1) DD2.12(D1) DD3.16(DB1) DD46.12(Q1) DD70.7(D1) DD72.28(D1) DD75.10(D1) DD78.33(D1) DD79.33(D1) DD80.35(D1)
BD2: DD1.13(D2) DD2.13(D2) DD3.11(DB2) DD46.11(Q2) DD70.6(D2) DD72.1(D2) DD75.9(D2) DD78.32(D2) DD79.32(D2) DD80.34(D2)
BD3: DD1.15(D3) DD2.15(D3) DD3.9(DB3) DD46.10(Q3) DD70.5(D3) DD72.2(D3) DD75.8(D3) DD78.31(D3) DD79.31(D3) DD80.33(D3)
BD4: DD1.16(D4) DD2.16(D4) DD3.5(DB4) DD47.13(Q0) DD70.4(D4) DD72.5(D4) DD75.7(D4) DD78.30(D4) DD79.30(D4) DD80.32(D4)
BD5: DD1.17(D5) DD2.17(D5) DD3.18(DB5) DD47.12(Q1) DD70.3(D5) DD72.6(D5) DD75.6(D5) DD78.29(D5) DD79.29(D5) DD80.31(D5)
BD6: DD1.18(D6) DD2.18(D6) DD3.20(DB6) DD47.11(Q2) DD70.2(D6) DD72.7(D6) DD75.5(D6) DD78.28(D6) DD79.28(D6) DD80.30(D6)
BD7: DD1.19(D7) DD2.19(D7) DD3.7(DB7) DD47.10(Q3) DD70.1(D7) DD72.8(D7) DD75.4(D7) DD78.27(D7) DD79.27(D7) DD80.29(D7)
BELL: R37.2 X2.B14(28)
BLANC: DD65.2 DD65.5(2) DD65.10(2) DD66.12(D0) R22.2
BLNK: DD10.13(3) DD66.15(A7)
BLUE: R30.2 XV1.5
BUSY_LP: DD23.13(2) R79.2 X3.11
C1: DD20.5(A1) DD24.12(1) DD25.14(C1)
C2: DD20.3(A2) DD25.12(1) DD26.14(C1)
C3: DD16.13(2) DD20.14(A3) DD26.1(C2) DD26.12(1)
C4: DD12.9(1) DD20.12(A4) DD26.9(2)
C5: DD22.1 DD26.3(R0) DD26.8(4)
C/M-: DD38.10(SES) DD39.10(SES) DD40.10(SES) DD41.10(SES) DD66.1(A6) DD67.24(PB6)
CAS1-: DD33.7(1) DD48.15(CAS) DD49.15(CAS) DD50.15(CAS) DD51.15(CAS) DD52.15(CAS) DD53.15(CAS) DD54.15(CAS) DD55.15(CAS)
CAS2-: DD33.9(2) DD56.15(CAS) DD57.15(CAS) DD58.15(CAS) DD59.15(CAS) DD60.15(CAS) DD61.15(CAS) DD62.15(CAS) DD63.15(CAS)
CD0: DD67.4(PA0) DD68.3(1)
CD1: DD67.3(PA1) DD69.13(1)
CD2: DD67.2(PA2) DD69.9(1)
CD3: DD67.1(PA3) DD69.3(1)
CD4: DD67.40(PA4) DD69.1
CD5: DD67.39(PA5) DD69.5(1)
CD6: DD67.38(PA6) DD69.11(1)
CD7: DD67.37(PA7) DD68.1
COL1: DD66.4(A3) DD67.18(PB0)
COL2: DD66.3(A4) DD67.19(PB1)
COL3: DD66.2(A5) DD67.20(PB2)
CP-EX: DD6.6(3) DD9.10(2) DD14.1(DS) DD14.3(D1)
CPU_F1: DD4.22(С1) DD7.7(O1)
CPU_F2: DD4.15(С2) DD7.5(O2)
CS00-: DD11.9(Y5) DD79.6(-CS)
CS20-: DD11.10(Y6) DD80.6(-CS)
CS40-: DD11.11(Y7) DD78.6(-CS)
CS60-: DD11.12(Y8) DD70.21(CS)
CS80-: DD11.7(Y1) DD75.1(CS-)
CS_ROM0-: DD1.20(CS-) DD6.3 DD9.2
CS_ROM1-: DD2.20(CS-) DD5.3 DD9.1
CSA0-: DD11.6(Y2) DD72.11(CS)
CSC0-: DD5.1 DD11.5(Y3) DD17.6(-CS)
CSE0-: DD5.5(2) DD11.4(Y4) DD67.6(-CS)
D0: DD3.15(D0) DD4.10(D0) DD17.34(D0) DD48.2(DI) DD56.2(DI) DD67.34(D0)
D1: DD3.17(D1) DD4.9(D1) DD9.9(1) DD17.33(D1) DD49.2(DI) DD57.2(DI) DD67.33(D1)
D2: DD3.12(D2) DD4.8(D2) DD17.32(D2) DD50.2(DI) DD58.2(DI) DD67.32(D2)
D3: DD3.10(D3) DD4.7(D3) DD17.31(D3) DD51.2(DI) DD59.2(DI) DD67.31(D3)
D4: DD3.6(D4) DD4.3(D4) DD5.9(1) DD17.30(D4) DD52.2(DI) DD60.2(DI) DD67.30(D4)
D5: DD3.19(D5) DD4.4(D5) DD17.29(D5) DD53.2(DI) DD61.2(DI) DD67.29(D5)
D6: DD3.21(D6) DD4.5(D6) DD5.10(2) DD17.28(D6) DD54.2(DI) DD62.2(DI) DD67.28(D6)
D7: DD3.8(D7) DD4.6(D7) DD17.27(D7) DD55.2(DI) DD63.2(DI) DD67.27(D7)
DB0: DD38.1(B2) DD39.3(A1) DD44.3(1.1) DD56.14(DO)
DB1: DD38.6(D2) DD39.4(B1) DD44.6(2.1) DD57.14(DO)
DB2: DD39.9(C1) DD40.1(B2) DD44.10(3.1) DD58.14(DO)
DB3: DD39.7(D1) DD40.6(D2) DD44.13(4.1) DD59.14(DO)
DB4: DD39.1(B2) DD41.3(A1) DD45.3(1.1) DD60.14(DO)
DB5: DD39.6(D2) DD41.4(B1) DD45.6(2.1) DD61.14(DO)
DB6: DD41.1(B2) DD41.9(C1) DD45.10(3.1) DD62.14(DO)
DB7: DD41.6(D2) DD41.7(D1) DD45.13(4.1) DD63.14(DO)
DC0: DD35.5(D3) DD38.15(1)
DC1: DD37.5(D3) DD38.14(2)
DC2: DD35.4(D2) DD38.13(3)
DC3: DD37.4(D2) DD38.12(4)
DC4: DD35.3(D1) DD40.15(1)
DC5: DD37.3(D1) DD40.14(2)
DC6: DD35.2(D0) DD40.13(3)
DC7: DD37.2(D0) DD40.12(4)
DD0: DD34.5(D3) DD39.15(1)
DD1: DD36.5(D3) DD39.14(2)
DD2: DD34.4(D2) DD39.13(3)
DD3: DD36.4(D2) DD39.12(4)
DD4: DD34.3(D1) DD41.15(1)
DD5: DD36.3(D1) DD41.14(2)
DD6: DD34.2(D0) DD41.13(3)
DD7: DD36.2(D0) DD41.12(4)
DRC1: DD82.8(DRC) R53.1
DSR-: DD72.22(DSR) DD73.12(R1OUT) XR2.6(R5)
DTR-: DD72.24(DTR) DD73.11(T1IN) XR2.5(R4)
ENROM-: DD5.2 DD5.4(1) DD17.22(PB4) R96.2
F1-: C2.2 DD16.3 R3.1
F2: DD13.9(Q) DD16.10(2) DD72.20(CLK)
F2-: C3.2 DD9.4(1) DD13.8(-Q) DD16.1 R4.1
F3: DD5.11(3) DD14.9(C) DD16.4(1)
FB1: DD82.5(CII) R54.1 R55.2
FB2: DD83.5(CII) R57.2 R58.2
FC1: DD82.7(Ipk) L2.2 R52.2 R53.2
FC2: DD83.1(SWC) DD83.7(Ipk) DD83.8(DRC) R51.1
FDC-PA0: DD80.4(PA0) X4.B12(24)
FDC-PA1: DD80.3(PA1) X4.B13(26)
FDC-PA2: DD80.2(PA2) X4.B14(28)
FDC-PA3: DD80.1(PA3) X4.A15(29)
FDC-PA4: DD80.42(PA4) X4.B15(30)
FDC-PA5: DD80.41(PA5) X4.A14(27)
FDC-PA6: DD80.40(PA6) X4.A13(25)
FDC-PA7: DD80.39(PA7) X4.A12(23)
FDC-PB0: DD80.18(PB0) X4.B5(10)
FDC-PB1: DD80.19(PB1) X4.B4(8)
FDC-PB2: DD80.20(PB2) X4.B3(6)
FDC-PB3: DD80.23(PB3) X4.A3(5)
FDC-PB4: DD80.24(PB4) X4.A4(7)
FDC-PB5: DD80.25(PB5) X4.A5(9)
FDC-PB6: DD80.26(PB6) X4.A6(11)
FDC-PB7: DD80.27(PB7) X4.A7(13)
FDC-PC0: DD80.14(PC0) X4.A9(17)
FDC-PC1: DD80.15(PC1) X4.B8(16)
FDC-PC2: DD80.16(PC2) X4.B7(14)
FDC-PC3: DD80.17(PC3) X4.B6(12)
FDC-PC4: DD80.13(PC4) X4.B10(20)
FDC-PC5: DD80.12(PC5) X4.A10(19)
FDC-PC6: DD80.11(PC6) X4.B11(22)
FDC-PC7: DD80.10(PC7) X4.A11(21)
FL1: DD65.1 DD67.21(PB3)
FL2: DD65.4(1) DD67.22(PB4)
FL3: DD65.9(1) DD67.23(PB5)
GC: DD22.2 DD24.1(C2) DD26.2(&) DD26.11(8) DD64.4(S) DD64.12(D) DD78.18(PB0)
GK: DD6.10(2) DD10.12(2) DD27.3(R0) DD27.11(8) DD78.19(PB1)
GREEN: R29.2 XV1.4
HS: DD23.9(1) DD64.5(Q)
HS1: DD17.17(PC3) DD20.6(B1)
HS2: DD17.13(PC4) DD20.2(B2)
HS3: DD17.12(PC5) DD20.15(B3)
HS4: DD17.11(PC6) DD20.11(B4)
HS5: DD17.10(PC7) DD23.1
iDSR: DD73.13(R1IN) XR1.6
INT: DD4.14(INT) DD75.17(INT)
INTA-: DD3.23(INTA) DD75.26(INTA-)
IOR-: DD3.25(IOR) DD70.22(RD) DD72.13(RD) DD75.3(RD-) DD78.5(-RD) DD79.5(-RD) DD80.5(-RD)
IOW-: DD3.27(IOWR) DD17.36(-WR) DD67.36(-WR) DD70.23(WR) DD72.10(WR) DD75.2(WR-) DD78.36(-WR) DD79.36(-WR) DD80.38(-WR)
iRXD: DD73.8(R2IN) XR1.2
JST1: DD78.23(PB5) R91.2 X2.A13(25)
JST2: DD78.24(PB6) R92.2 X2.A12(23)
JST3: DD78.25(PB7) R93.2 X2.A11(21)
K1: DD18.5(A1) DD24.9(2)
K2: DD18.3(A2) DD24.8(4)
K3: DD18.14(A3) DD24.11(8) DD25.1(C2)
K4: DD18.12(A4) DD25.9(2)
K5: DD6.9(1) DD19.5(A1) DD25.8(4)
K6: DD12.5(1) DD19.3(A2) DD25.11(8) DD27.1(C2)
K7: DD19.14(A3) DD27.2(&) DD27.9(2)
K8: DD19.12(A4) DD27.8(4)
L_SYN: R11.2 VT1.3(B) VT2.3(B)
LG1: DD13.2(D) DD13.10(S) DD14.8(EO) DD15.1(D1) DD15.4(C2) DD15.9(D3) DD17.5(-RD) DD31.3(1.3) DD33.3(1.3) DD33.11(2.1) DD42.4(C2) DD42.11(-V) DD43.2(Y<X) DD43.3(Y=X) DD43.4(Y>X) DD43.10(Y0) DD46.1(DS) DD46.6(EL) DD47.1(DS) DD47.6(EL) DD64.1(R) DD64.10(S) DD64.13(R) DD67.5(-RD) DD70.11(CE0) DD70.14(CE1) DD75.16(M/S) R8.1 S3.3
LG2: DD34.8(EO) DD35.8(EO) DD36.8(EO) DD37.8(EO) R10.2
LP0: DD68.4(2) R49.1 X3.2
LP1: DD69.12(2) R48.1 X3.3
LP2: DD69.8(2) R47.1 X3.4
LP3: DD69.4(2) R46.1 X3.5
LP4: DD69.2 R45.1 X3.6
LP5: DD69.6(2) R44.1 X3.7
LP6: DD69.10(2) R43.1 X3.8
LP7: DD68.2 R42.1 X3.9
MA0: DD28.7(1) DD48.5(A0) DD49.5(A0) DD50.5(A0) DD51.5(A0) DD52.5(A0) DD53.5(A0) DD54.5(A0) DD55.5(A0) DD56.5(A0) DD57.5(A0) DD58.5(A0) DD59.5(A0) DD60.5(A0) DD61.5(A0) DD62.5(A0) DD63.5(A0)
MA1: DD28.9(2) DD48.7(A1) DD49.7(A1) DD50.7(A1) DD51.7(A1) DD52.7(A1) DD53.7(A1) DD54.7(A1) DD55.7(A1) DD56.7(A1) DD57.7(A1) DD58.7(A1) DD59.7(A1) DD60.7(A1) DD61.7(A1) DD62.7(A1) DD63.7(A1)
MA2: DD29.7(1) DD48.6(A2) DD49.6(A2) DD50.6(A2) DD51.6(A2) DD52.6(A2) DD53.6(A2) DD54.6(A2) DD55.6(A2) DD56.6(A2) DD57.6(A2) DD58.6(A2) DD59.6(A2) DD60.6(A2) DD61.6(A2) DD62.6(A2) DD63.6(A2)
MA3: DD29.9(2) DD48.12(A3) DD49.12(A3) DD50.12(A3) DD51.12(A3) DD52.12(A3) DD53.12(A3) DD54.12(A3) DD55.12(A3) DD56.12(A3) DD57.12(A3) DD58.12(A3) DD59.12(A3) DD60.12(A3) DD61.12(A3) DD62.12(A3) DD63.12(A3)
MA4: DD30.7(1) DD48.11(A4) DD49.11(A4) DD50.11(A4) DD51.11(A4) DD52.11(A4) DD53.11(A4) DD54.11(A4) DD55.11(A4) DD56.11(A4) DD57.11(A4) DD58.11(A4) DD59.11(A4) DD60.11(A4) DD61.11(A4) DD62.11(A4) DD63.11(A4)
MA5: DD30.9(2) DD48.10(A5) DD49.10(A5) DD50.10(A5) DD51.10(A5) DD52.10(A5) DD53.10(A5) DD54.10(A5) DD55.10(A5) DD56.10(A5) DD57.10(A5) DD58.10(A5) DD59.10(A5) DD60.10(A5) DD61.10(A5) DD62.10(A5) DD63.10(A5)
MA6: DD31.7(1) DD48.13(A6) DD49.13(A6) DD50.13(A6) DD51.13(A6) DD52.13(A6) DD53.13(A6) DD54.13(A6) DD55.13(A6) DD56.13(A6) DD57.13(A6) DD58.13(A6) DD59.13(A6) DD60.13(A6) DD61.13(A6) DD62.13(A6) DD63.13(A6)
MA7: DD31.9(2) DD48.9(A7) DD49.9(A7) DD50.9(A7) DD51.9(A7) DD52.9(A7) DD53.9(A7) DD54.9(A7) DD55.9(A7) DD56.9(A7) DD57.9(A7) DD58.9(A7) DD59.9(A7) DD60.9(A7) DD61.9(A7) DD62.9(A7) DD63.9(A7)
MA8: DD32.7(1) DD48.1(A8) DD49.1(A8) DD50.1(A8) DD51.1(A8) DD52.1(A8) DD53.1(A8) DD54.1(A8) DD55.1(A8) DD56.1(A8) DD57.1(A8) DD58.1(A8) DD59.1(A8) DD60.1(A8) DD61.1(A8) DD62.1(A8) DD63.1(A8)
MD0: DD38.2(A2) DD38.3(A1) DD44.2(1.0) DD48.14(DO)
MD1: DD38.4(B1) DD38.5(C2) DD44.5(2.0) DD49.14(DO)
MD2: DD38.9(C1) DD40.2(A2) DD44.11(3.0) DD50.14(DO)
MD3: DD38.7(D1) DD40.5(C2) DD44.14(4.0) DD51.14(DO)
MD4: DD39.2(A2) DD40.3(A1) DD45.2(1.0) DD52.14(DO)
MD5: DD39.5(C2) DD40.4(B1) DD45.5(2.0) DD53.14(DO)
MD6: DD40.9(C1) DD41.2(A2) DD45.11(3.0) DD54.14(DO)
MD7: DD40.7(D1) DD41.5(C2) DD45.14(4.0) DD55.14(DO)
MEMR-: DD1.22(OE-) DD2.22(OE-) DD3.24(MEMR) DD10.3(2)
MEMW-: DD3.26(MEMW) S1.3
oDTR: DD73.14(T1OUT) XR1.4
OERAM: DD10.1(3) DD46.8(EO) DD47.8(EO)
oTXD: DD73.7(T2OUT) XR1.3
P0-PA0: DD79.4(PA0) X5.B12(24)
P0-PA1: DD79.3(PA1) X5.B13(26)
P0-PA2: DD79.2(PA2) X5.B14(28)
P0-PA3: DD79.1(PA3) X5.A15(29)
P0-PA4: DD79.40(PA4) X5.B15(30)
P0-PA5: DD79.39(PA5) X5.A14(27)
P0-PA6: DD79.38(PA6) X5.A13(25)
P0-PA7: DD79.37(PA7) X5.A12(23)
P0-PB0: DD79.18(PB0) X5.B5(10)
P0-PB1: DD79.19(PB1) X5.B4(8)
P0-PB2: DD79.20(PB2) X5.B3(6)
P0-PB3: DD79.21(PB3) X5.A3(5)
P0-PB4: DD79.22(PB4) X5.A4(7)
P0-PB5: DD79.23(PB5) X5.A5(9)
P0-PB6: DD79.24(PB6) X5.A6(11)
P0-PB7: DD79.25(PB7) X5.A7(13)
P0-PC0: DD79.14(PC0) X5.A9(17)
P0-PC1: DD79.15(PC1) X5.B8(16)
P0-PC2: DD79.16(PC2) X5.B7(14)
P0-PC3: DD79.17(PC3) X5.B6(12)
P0-PC4: DD79.13(PC4) X5.B10(20)
P0-PC5: DD79.12(PC5) X5.A10(19)
P0-PC6: DD79.11(PC6) X5.B11(22)
P0-PC7: DD79.10(PC7) X5.A11(21)
P4-PA0: DD78.4(PA0) X2.A5(9)
P4-PA1: DD78.3(PA1) X2.B5(10)
P4-PA2: DD78.2(PA2) X2.A4(7)
P4-PA3: DD78.1(PA3) X2.B4(8)
P4-PA4: DD78.40(PA4) X2.B6(12)
P4-PA5: DD78.39(PA5) X2.A6(11)
P4-PA6: DD78.38(PA6) X2.B7(14)
P4-PA7: DD78.37(PA7) X2.A7(13)
P4-PC0: DD78.14(PC0) X2.A10(19)
P4-PC1: DD78.15(PC1) X2.B11(22)
P4-PC2: DD78.16(PC2) X2.B12(24)
P4-PC3: DD78.17(PC3) X2.B13(26)
P4-PC4: DD78.13(PC4) X2.B10(20)
P4-PC5: DD78.12(PC5) X2.A9(17)
P4-PC6: DD78.11(PC6) X2.A8(15)
P4-PC7: DD78.10(PC7) X2.B8(16)
R2: DD10.9(2) DD14.2(D0) DD14.4(D2) DD14.12(Q1)
RAM: DD9.3 DD10.2(1) DD10.5(1)
RAS-: DD16.6(3) DD48.4(RAS) DD49.4(RAS) DD50.4(RAS) DD51.4(RAS) DD52.4(RAS) DD53.4(RAS) DD54.4(RAS) DD55.4(RAS) DD56.4(RAS) DD57.4(RAS) DD58.4(RAS) DD59.4(RAS) DD60.4(RAS) DD61.4(RAS) DD62.4(RAS) DD63.4(RAS)
READY: DD4.23(RDY) DD80.22(RDSYS) R2.2
RED: R28.2 XV1.3
RESET: DD4.12(RES) DD12.2 DD17.35(RES) DD67.35(RES) DD72.21(RESET) DD78.35(RES) DD79.35(RES) DD80.37(RES)
REST: DD8.1 DD17.23(PB5) R97.2
RG1: DD35.10(Q3) DD66.6(A1)
RG2: DD37.10(Q3) DD66.7(A2)
ROMA13: DD1.26(A13) DD2.26(A13) DD17.24(PB6) R94.2
ROMA14: DD17.25(PB7) R95.2 S1.1 S3.1
RST0: DD71.4(2) DD75.18(IR0)
RST1: DD71.2 DD75.19(IR1)
RST2: DD72.14(RXRDY) DD75.20(IR2)
RST3: DD23.11(3) DD75.21(IR3)
RST4: DD70.10(OUT1) DD75.22(IR4)
RST5: DD71.8(2) DD75.23(IR5)
RST6: DD71.10(2) DD75.24(IR6)
RST7: DD71.12(2) DD75.25(IR7)
RST_0: DD71.3(1) R78.2 X2.A15(29)
RST_1: DD71.1 R82.2 X2.B15(30)
RST_6: DD71.11(1) R83.2 XT1.4(RST6)
RST_7: DD71.13(1) R84.2 XT1.5(RST7)
RST_BTN: C1.1(P) DD12.1 R1.2 X2.B9(18)
RXD: DD72.3(RXD) DD73.9(R2OUT) XR2.3(R2)
S1: DD8.3(1) DD14.10(Q3) DD22.9(1) DD28.14(SE0) DD29.14(SE0) DD30.14(SE0) DD31.14(SE0) DD32.14(SE0) DD38.11(SYN) DD39.11(SYN) DD40.11(SYN) DD41.11(SYN)
S2: DD5.13(2) DD13.12(D) DD13.13(R) DD15.2(Q1) DD28.2(SE1) DD29.2(SE1) DD30.2(SE1) DD31.2(SE1) DD32.2(SE1)
S2_SEL: DD23.12(1) S2.2
SB1: DD17.14(PC0) DD43.12(Y1)
SB2: DD17.15(PC1) DD43.13(Y2)
SB3: DD17.16(PC2) DD43.15(Y3)
SC1: DD20.4(S1) DD28.5(1.1)
SC2: DD20.1(S2) DD28.11(2.1)
SC3: DD20.13(S3) DD29.5(1.1)
SC4: DD20.10(S4) DD29.11(2.1)
SC5: DD23.6(3) DD30.5(1.1)
SK1: DD18.4(S1) DD30.11(2.1)
SK2: DD18.1(S2) DD31.5(1.1)
SK3: DD18.13(S3) DD31.11(2.1)
SK4: DD18.10(S4) DD28.13(2.3)
SK5: DD19.4(S1) DD29.3(1.3)
SK6: DD19.1(S2) DD29.13(2.3)
SK7: DD19.13(S3) DD30.3(1.3)
SK8: DD19.10(S4) DD30.13(2.3)
SR: DD14.13(Q0) DD22.10(2) DD33.14(SE0) DD46.9(C) DD47.9(C)
STB-LP: DD68.12(2) R41.1 X3.1
SWO1: DD82.1(SWC) L2.1 VD13.1
SWO2: DD83.2(SWE) L1.2 VD6.2
SYNC: DD4.19(SYNC) DD6.5(2) DD9.5(2)
SYNH: R26.2 XV1.8
TAPE1: DD67.14(PC0) R31.1
TAPE2: DD67.15(PC1) R32.1
TAPE3: DD67.16(PC2) R33.1
TAPE4: DD78.20(PB2) R76.2 VT17.2(C)
TAPE5: DD78.21(PB3) R70.1 VD10.2
TapeIn: C5.2 XM1.2(In)
TapeOut: C4.1 R35.1 XM1.1(Out)
TC1: C20.2 DD82.3(TC)
TC2: C18.2 DD83.3(TC)
TIM_EN: DD12.3(1) R50.2 XT1.2(TE)
TIM_IN: DD12.11(1) XT1.3(TI)
TIM_OUT: DD12.12(2) XT1.1(TO)
TXD: DD72.19(TXD) DD73.10(T2IN) XR2.4(R3)
U_RST: DD71.9(1) R61.2
USER1: DD68.10(2) R40.1 XU1.4(UO1)
USER2: DD68.8(2) R39.1 XU1.3(UO2)
USER3: DD68.6(2) R38.1 XU1.5(UO3)
VD: R12.2 R16.2 R17.2 R18.2 VT3.3(B) VT4.3(B)
Video: R27.2 XV1.7
VR: DD13.3(С) DD24.14(C1) DD42.12(P-) DD71.5(1)
VR-: DD34.6(EL) DD35.6(EL) DD36.6(EL) DD37.6(EL) DD71.6(2)
VS: DD6.11(3) DD23.10(2)
VS1: DD17.4(PA0) DD18.6(B1)
VS2: DD17.3(PA1) DD18.2(B2)
VS3: DD17.2(PA2) DD18.15(B3)
VS4: DD17.1(PA3) DD18.11(B4)
VS5: DD17.40(PA4) DD19.6(B1)
VS6: DD17.39(PA5) DD19.2(B2)
VS7: DD17.38(PA6) DD19.15(B3)
VS8: DD17.37(PA7) DD19.11(B4)
VSU: DD31.13(2.3) DD67.25(PB7)
WE: DD8.13(1) DD14.11(Q2)
WE-: DD8.12(2) DD48.3(WE) DD49.3(WE) DD50.3(WE) DD51.3(WE) DD52.3(WE) DD53.3(WE) DD54.3(WE) DD55.3(WE) DD56.3(WE) DD57.3(WE) DD58.3(WE) DD59.3(WE) DD60.3(WE) DD61.3(WE) DD62.3(WE) DD63.3(WE)
Net-(C2-1): C2.1 DD7.2(I1) R3.2
Net-(C3-1): C3.1 DD7.4(I2) R4.2
Net-(C4-2): C4.2 R34.1 VD4.1 VD5.2 VT11.1(E)
Net-(C5-1): C5.1 R62.2 R63.1 R64.2
Net-(C6-1): C6.1 C9.2 DA21.3(+) DA76.6(Out) R66.1
Net-(C6-2): C6.2 R64.1 R65.2
Net-(C7-1): C7.1 DA76.3(+) R65.1
Net-(C8-1): C8.1 R67.2
Net-(C9-1): C9.1 R68.2
Net-(C10-1): C10.1 R69.1 R70.2 VT16.2(C)
Net-(C11-1): C11.1 R71.2
Net-(C12-1): C12.1 DA21.2(-) DA77.2(-) R71.1 R72.2 VD11.1 VD12.2
Net-(C12-2): C12.2 DA21.6(Out) R72.1 R73.2 VD11.2 VD12.1
Net-(CR1-1): CR1.1 DD73.1(C1+)
Net-(CR1-2): CR1.2 DD73.3(C1-)
Net-(CR2-1): CR2.1 DD73.4(C2+)
Net-(CR2-2): CR2.2 DD73.5(C2-)
Net-(CR3-2): CR3.2 DD73.2(V+)
Net-(CR4-2): CR4.2 DD73.6(V-)
Net-(DA76-2): DA76.2(-) R66.2 R67.1
Net-(DA77-3): DA77.3(+) R73.1 R74.2
Net-(DA77-6): DA77.6(Out) R74.1 R75.2
Net-(DD3-1): DD3.1(SSTB) DD9.6(3)
Net-(DD3-3): DD3.3(WR) DD4.18(-WR)
Net-(DD3-4): DD3.4(DBIN) DD4.17(DBIN)
Net-(DD5.2-6): DD5.6(3) DD6.1
Net-(DD5.3-8): DD5.8(3) DD10.6(2)
Net-(DD5.4-12): DD5.12(1) DD15.3(Q0) DD16.2
Net-(DD6.1-2): DD6.2 DD8.2
Net-(DD6.2-4): DD6.4(1) DD10.4(3)
Net-(DD6.3-8): DD6.8(3) DD6.12(1)
Net-(DD6.4-13): DD6.13(2) DD12.6(2)
Net-(DD8.2-4): DD8.4(2) DD13.1(R)
Net-(DD8.3-5): DD8.5(1) R5.1 ZQ1.2(OSC2)
Net-(DD8.3-6): DD8.6(2) DD8.9(1) R5.2 R6.1
Net-(DD8.4-8): DD8.8(2) DD8.11(1) DD13.11(C) R6.2 ZQ1.1(OSC1)
Net-(DD9.3-8): DD9.8(3) DD9.12(1) DD14.6(EL)
Net-(DD9.4-11): DD9.11(3) DD10.8(1)
Net-(DD9.4-13): DD9.13(2) DD13.5(Q)
Net-(DD10.3-10): DD10.10(3) DD14.5(D3)
Net-(DD10.4-11): DD10.11(1) DD64.9(Q)
Net-(DD12.2-4): DD12.4(2) DD70.16(CE2)
Net-(DD12.4-8): DD12.8(2) DD16.12(1)
Net-(DD12.5-10): DD12.10(2) DD70.18(C2)
Net-(DD12.6-13): DD12.13(1) DD70.17(OUT3)
Net-(DD13.1-4): DD13.4(S) DD13.6(&#126;Q)
Net-(DD15-11): DD15.11(-V) DD15.12(P-)
Net-(DD16.2-5): DD16.5(2) DD16.9(1) DD22.8(3)
Net-(DD16.3-8): DD16.8(3) DD33.4(1.2) DD33.5(1.1) DD33.6(1.0) DD33.10(2.0) DD33.12(2.2) DD33.13(2.3)
Net-(DD16.4-11): DD16.11(3) DD64.2(D)
Net-(DD18-9): DD18.9(P4) DD19.7(P0)
Net-(DD20-9): DD20.9(P4) DD23.4(1)
Net-(DD22.1-3): DD22.3 DD23.2
Net-(DD23.1-3): DD23.3 DD23.5(2)
Net-(DD23.3-8): DD23.8(3) DD65.12(1) DD65.13(2) S4.3
Net-(DD34-10): DD34.10(Q3) DD35.1(DS)
Net-(DD36-10): DD36.10(Q3) DD37.1(DS)
Net-(DD43-6): DD43.6(Y=X) DD64.3(С) DD64.11(C)
Net-(DD44-4): DD44.4(1) DD46.2(D0)
Net-(DD44-7): DD44.7(2) DD46.3(D1)
Net-(DD44-9): DD44.9(3) DD46.4(D2)
Net-(DD44-12): DD44.12(4) DD46.5(D3)
Net-(DD45-4): DD45.4(1) DD47.2(D0)
Net-(DD45-7): DD45.7(2) DD47.3(D1)
Net-(DD45-9): DD45.9(3) DD47.4(D2)
Net-(DD45-12): DD45.12(4) DD47.5(D3)
Net-(DD65.1-3): DD65.3 VD1.1
Net-(DD65.2-6): DD65.6(3) VD2.1
Net-(DD65.3-8): DD65.8(3) VD3.1
Net-(DD65.4-11): DD65.11(3) S4.1
Net-(DD66-9): DD66.9(D3) R18.1 R21.1 R25.2
Net-(DD66-10): DD66.10(D2) R17.1 R20.1 R24.2
Net-(DD66-11): DD66.11(D1) R16.1 R19.1 R23.2
Net-(DD67-10): DD67.10(PC7) DD68.5(1)
Net-(DD67-11): DD67.11(PC6) DD68.9(1)
Net-(DD67-12): DD67.12(PC5) DD68.11(1)
Net-(DD67-13): DD67.13(PC4) DD68.13(1)
Net-(DD67-17): DD67.17(PC3) R36.1
Net-(DD70-13): DD70.13(OUT2) DD72.9(TXC) DD72.25(RXC)
Net-(R11-1): R11.1 R12.1 S4.2
Net-(R13-1): R13.1 VD1.2
Net-(R13-2): R13.2 R21.2 VT5.3(B) VT6.3(B)
Net-(R14-1): R14.1 VD2.2
Net-(R14-2): R14.2 R20.2 VT9.3(B) VT10.3(B)
Net-(R15-1): R15.1 VD3.2
Net-(R15-2): R15.2 R19.2 VT7.3(B) VT8.3(B)
Net-(R26-1): R26.1 VT1.1(E) VT2.1(E)
Net-(R27-1): R27.1 VT3.1(E) VT4.1(E)
Net-(R28-1): R28.1 VT5.1(E) VT6.1(E)
Net-(R29-1): R29.1 VT7.1(E) VT8.1(E)
Net-(R30-1): R30.1 VT9.1(E) VT10.1(E)
Net-(R31-2): R31.2 R32.2 R33.2 VT11.3(B)
Net-(R36-2): R36.2 VT12.3(B) VT13.3(B)
Net-(R37-1): R37.1 VT12.1(E) VT13.1(E)
Net-(R68-1): R68.1 VD9.1 VT16.3(B)
Net-(R75-1): R75.1 R77.1 VT17.3(B)
Net-(R80-2): R80.2 S2.1

Not connected (* = marked no-connect by the designer): DA21 1(Off+)* 5(Off-)*; DA76 1(Off+)* 5(Off-)*; DA77 1(Off+)* 5(Off-)*; DD1 14(GND) 28(VCC); DD2 14(GND) 28(VCC); DD3 14(GND) 28(VCC); DD4 16(INTE)* 21(HLDA)* 24(WAIT)*; DD5 7(GND) 14(VCC); DD6 7(GND) 14(VCC); DD8 7(GND) 14(VCC); DD9 7(GND) 14(VCC); DD10 7(GND) 14(VCC); DD11 8(GND) 16(VCC); DD12 7(GND) 14(VCC); DD13 7(GND) 14(VCC); DD14 7(GND) 14(VCC); DD15 6(Q2)* 7(Q3)* 8(GND) 13(B-)* 16(VCC); DD16 7(GND) 14(VCC); DD17 7(GND) 26(VCC); DD18 8(GND) 16(VCC); DD19 8(GND) 9(P4)* 16(VCC); DD20 8(GND) 16(VCC); DD22 7(GND) 14(VCC); DD23 7(GND) 14(VCC); DD24 5(VCC) 10(GND); DD25 5(VCC) 10(GND); DD26 5(VCC) 10(GND); DD27 5(VCC) 10(GND) 12(1)* 14(C1)*; DD28 8(GND) 16(VCC); DD29 8(GND) 16(VCC); DD30 8(GND) 16(VCC); DD31 8(GND) 16(VCC); DD32 8(GND) 9(2)* 16(VCC); DD33 8(GND) 16(VCC); DD34 1(DS)* 7(GND) 11(Q2)* 12(Q1)* 13(Q0)* 14(VCC); DD35 7(GND) 11(Q2)* 12(Q1)* 13(Q0)* 14(VCC); DD36 1(DS)* 7(GND) 11(Q2)* 12(Q1)* 13(Q0)* 14(VCC); DD37 7(GND) 11(Q2)* 12(Q1)* 13(Q0)* 14(VCC); DD38 8(GND) 16(VCC); DD39 8(GND) 16(VCC); DD40 8(GND) 16(VCC); DD41 8(GND) 16(VCC); DD42 8(GND) 13(B-)* 16(VCC); DD43 5(Y>X)* 7(Y<X)* 8(GND) 16(VCC); DD44 8(GND) 16(VCC); DD45 8(GND) 16(VCC); DD46 7(GND) 14(VCC); DD47 7(GND) 14(VCC); DD48 8(VCC) 16(GND); DD49 8(VCC) 16(GND); DD50 8(VCC) 16(GND); DD51 8(VCC) 16(GND); DD52 8(VCC) 16(GND); DD53 8(VCC) 16(GND); DD54 8(VCC) 16(GND); DD55 8(VCC) 16(GND); DD56 8(VCC) 16(GND); DD57 8(VCC) 16(GND); DD58 8(VCC) 16(GND); DD59 8(VCC) 16(GND); DD60 8(VCC) 16(GND); DD61 8(VCC) 16(GND); DD62 8(VCC) 16(GND); DD63 8(VCC) 16(GND); DD64 6(&#126;Q)* 7(GND) 8(-Q)* 14(VCC); DD65 7(GND) 14(VCC); DD67 7(GND) 26(VCC); DD68 7(GND) 14(VCC); DD69 7(GND) 14(VCC); DD70 12(GND) 24(VCC); DD71 7(GND) 14(VCC); DD72 4(GND) 15(TXRDY)* 16(SYNDET)* 18(TXE)* 23(RTS)* 26(VCC); DD73 15(GND) 16(VCC); DD75 12(CAS0)* 13(CAS1)* 14(GND) 15(CAS2)* 28(VCC); DD78 7(GND) 26(VCC); DD79 7(GND) 26(VCC); X3 12* 13* 14* 15* 16* 17*; XR1 1* 7* 8* 9*; XV1 6* 10*

## Notes on the sheets
sheet 1
- Постоянная память
- Синхрогенератор
- Дешифратор памяти
- Процессор
- Шинный формирователь
- REST="1" после включения или RESET-а
- CP-EX = "0" когда нет обмена с ЦП
sheet 2
- Видео-счетчики адреса ОЗУ
- Устройство вертикального сдвига
- GC - Гашение строки
- GK - Гашение кадра
- K1-K8 - номер строки изображения
  SK1-SK8 - адрес строки со смещением
  SC1-SC5 - адрес колонки со смещением
- DD17
  Порт А - вертикальное смещение изображения
  Порт B - переключение страниц памяти
  Порт C PC0-2 - горизонтальное смещение изображения на пиксел
  Порт C PC3-7 - горизонтальное смещение изображения на знакоместо (8 пикс)
- Устройство горизнтального сдвига
sheet 3
- Видео-регистры
sheet 4
- FL1-3 - Цвет фона
- COL1-3 - управление цветом
  C/M- - Color/Mono
- Горизонтальный сдвиг на пиксел
- VR (разрешение записи информации
  в регистры видеоконтроллера)
- VS = (K5 & GK) & !K6
sheet 7
- Для внешних устройств пользователя
- Порты A и С, B5-7 - Клавиатура
- Для устройств пользователя или FDC
